# EAGLE design alphanewt_v1.3 (EAGLE 8.2.2)
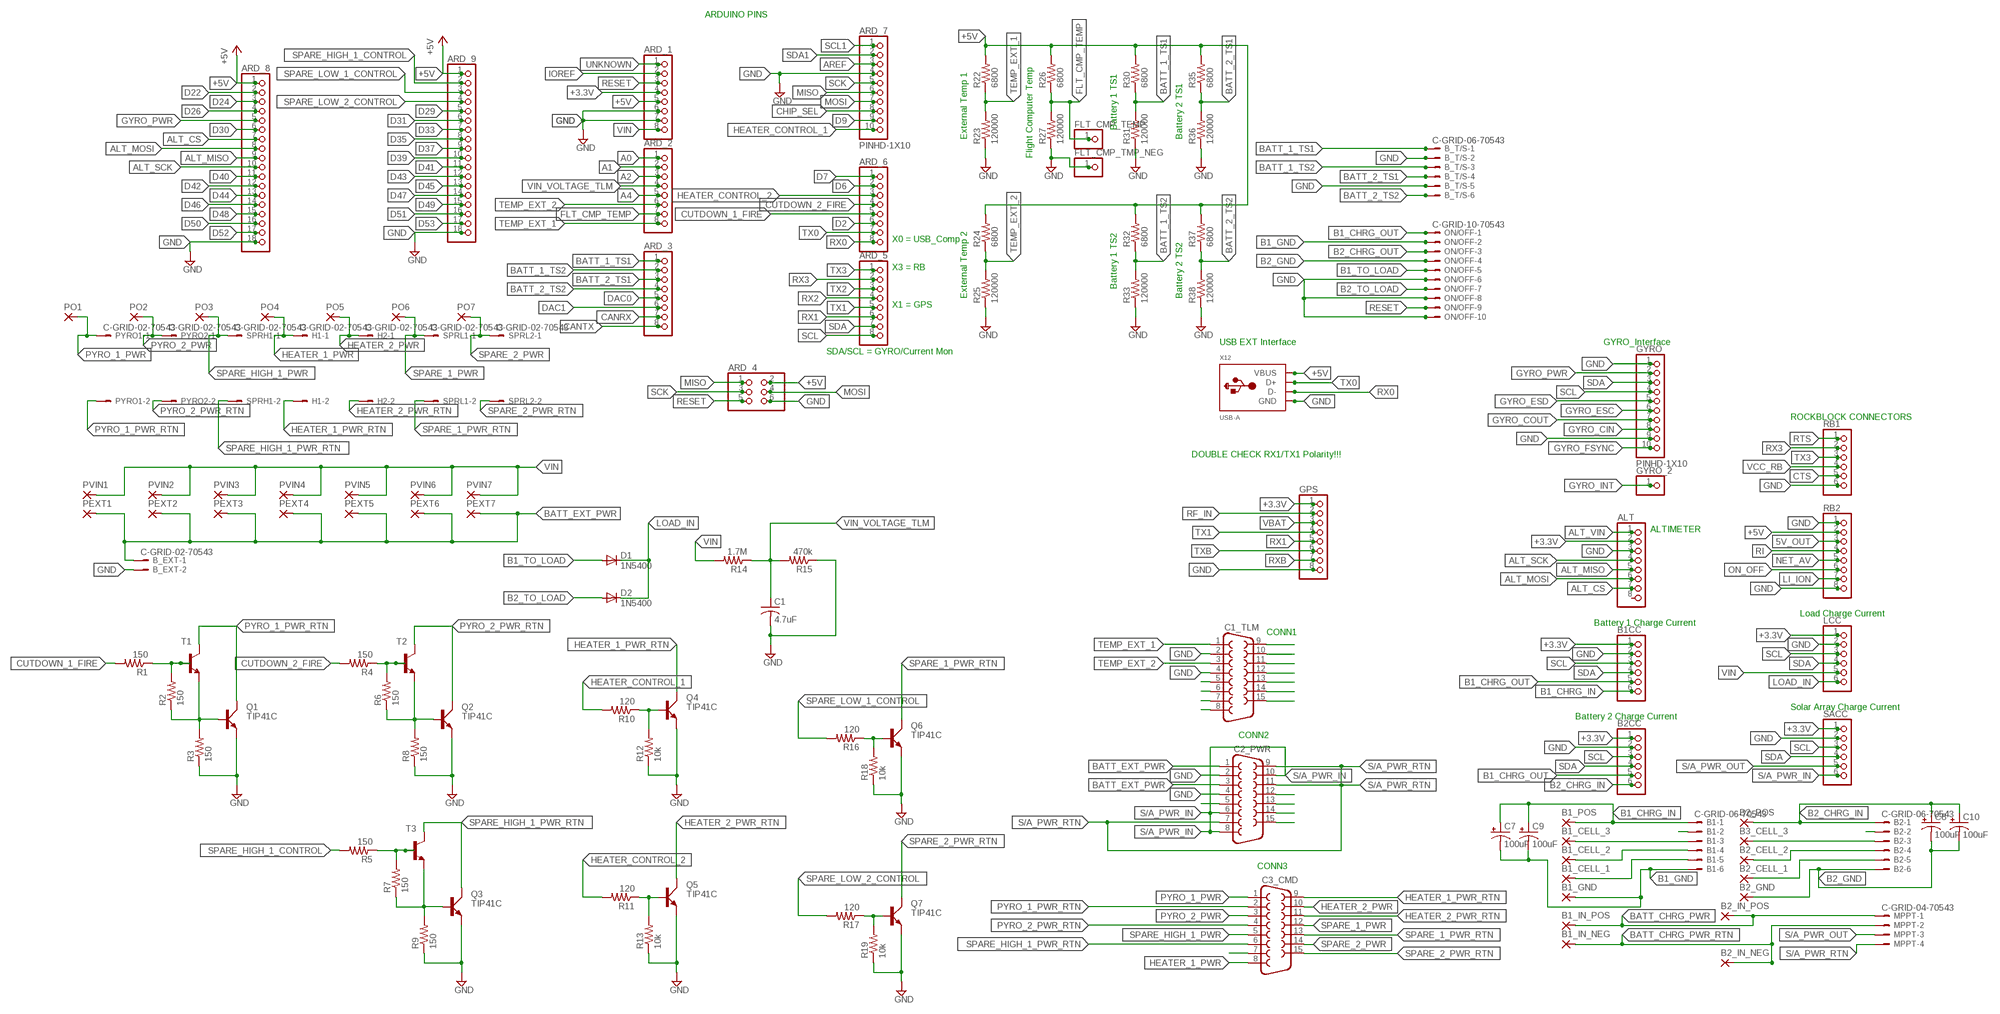
[diagram p0: schematic, sheet 1]

## Parts
ALT  PINHD-1X8BIG  [1X08-BIG]
ARD_1  PINHD-1X8BIG  [1X08-BIG]
ARD_2  PINHD-1X8BIG  [1X08-BIG]
ARD_3  PINHD-1X8BIG  [1X08-BIG]
ARD_4  PINHD-2X3  [2X03]
ARD_5  PINHD-1X8BIG  [1X08-BIG]
ARD_6  PINHD-1X8BIG  [1X08-BIG]
ARD_7  PINHD-1X10  [1X10-BIG]
ARD_8  PINHD-1X18-BIG  [1X18-BIG]
ARD_9  PINHD-1X18-BIG  [1X18-BIG]
B1  C-GRID-06-70543  [70543-06]
B1_CELL_1  SMD5  [SMD2,54-5,08]
B1_CELL_2  SMD5  [SMD2,54-5,08]
B1_CELL_3  SMD5  [SMD2,54-5,08]
B1_GND  SMD5  [SMD2,54-5,08]
B1_IN_NEG  SMD5  [SMD2,54-5,08]
B1_IN_POS  SMD5  [SMD2,54-5,08]
B1_POS  SMD5  [SMD2,54-5,08]
B1CC  PINHD-1X6B  [1X06-BIG]
B2  C-GRID-06-70543  [70543-06]
B2_CELL_1  SMD5  [SMD2,54-5,08]
B2_CELL_2  SMD5  [SMD2,54-5,08]
B2_GND  SMD5  [SMD2,54-5,08]
B2_IN_NEG  SMD5  [SMD2,54-5,08]
B2_IN_POS  SMD5  [SMD2,54-5,08]
B2_POS  SMD5  [SMD2,54-5,08]
B2CC  PINHD-1X6B  [1X06-BIG]
B3_CELL_3  SMD5  [SMD2,54-5,08]
B_EXT  C-GRID-02-70543  [70543-02]
B_T/S  C-GRID-06-70543  [70543-06]
C1  4.7uF  C-USC0805K  [C0805K]
C1_TLM  F15HP  [F15HP]
C2_PWR  F15HP  [F15HP]
C3_CMD  F15HP  [F15HP]
C7  100uF  CPOL-USCT7343  [CT7343]
C8  100uF  CPOL-USCT7343  [CT7343]
C9  100uF  CPOL-USCT7343  [CT7343]
C10  100uF  CPOL-USCT7343  [CT7343]
D1  1N5400  [DO201-15]
D2  1N5400  [DO201-15]
FLT_CMP_TEMP  PINHD-1X1  [1X01]
FLT_CMP_TMP_NEG  PINHD-1X1  [1X01]
GPS  PINHD-1X8BIG  [1X08-BIG]
GYRO  PINHD-1X10  [1X10-BIG]
GYRO_2  PINHD-1X1  [1X01]
H1  C-GRID-02-70543  [70543-02]
H2  C-GRID-02-70543  [70543-02]
LCC  PINHD-1X6B  [1X06-BIG]
MPPT  C-GRID-04-70543  [70543-04]
ON/OFF  C-GRID-10-70543  [70543-10]
PEXT1  SMD2  [SMD1,27-2,54]
PEXT2  SMD2  [SMD1,27-2,54]
PEXT3  SMD2  [SMD1,27-2,54]
PEXT4  SMD2  [SMD1,27-2,54]
PEXT5  SMD2  [SMD1,27-2,54]
PEXT6  SMD2  [SMD1,27-2,54]
PEXT7  SMD2  [SMD1,27-2,54]
PO1  SMD2  [SMD1,27-2,54]
PO2  SMD2  [SMD1,27-2,54]
PO3  SMD2  [SMD1,27-2,54]
PO4  SMD2  [SMD1,27-2,54]
PO5  SMD2  [SMD1,27-2,54]
PO6  SMD2  [SMD1,27-2,54]
PO7  SMD2  [SMD1,27-2,54]
PVIN1  SMD2  [SMD1,27-2,54]
PVIN2  SMD2  [SMD1,27-2,54]
PVIN3  SMD2  [SMD1,27-2,54]
PVIN4  SMD2  [SMD1,27-2,54]
PVIN5  SMD2  [SMD1,27-2,54]
PVIN6  SMD2  [SMD1,27-2,54]
PVIN7  SMD2  [SMD1,27-2,54]
PYRO1  C-GRID-02-70543  [70543-02]
PYRO2  C-GRID-02-70543  [70543-02]
Q1  TIP41C  [TO220AV]
Q2  TIP41C  [TO220AV]
Q3  TIP41C  [TO220AV]
Q4  TIP41C  [TO220AV]
Q5  TIP41C  [TO220AV]
Q6  TIP41C  [TO220AV]
Q7  TIP41C  [TO220AV]
R1  150  R-US_R0805  [R0805]
R2  150  R-US_R0805  [R0805]
R3  150  R-US_R0805  [R0805]
R4  150  R-US_R0805  [R0805]
R5  150  R-US_R0805  [R0805]
R6  150  R-US_R0805  [R0805]
R7  150  R-US_R0805  [R0805]
R8  150  R-US_R0805  [R0805]
R9  150  R-US_R0805  [R0805]
R10  120  R-US_R0805  [R0805]
R11  120  R-US_R0805  [R0805]
R12  10k  R-US_R0805  [R0805]
R13  10k  R-US_R0805  [R0805]
R14  1.7M  R-US_R0805  [R0805]
R15  470k  R-US_R0805  [R0805]
R16  120  R-US_R0805  [R0805]
R17  120  R-US_R0805  [R0805]
R18  10k  R-US_R0805  [R0805]
R19  10k  R-US_R0805  [R0805]
R22  6800  R-US_R0805  [R0805]
R23  120000  R-US_R0805  [R0805]
R24  6800  R-US_R0805  [R0805]
R25  120000  R-US_R0805  [R0805]
R26  6800  R-US_R0805  [R0805]
R27  120000  R-US_R0805  [R0805]
R30  6800  R-US_R0805  [R0805]
R31  120000  R-US_R0805  [R0805]
R32  6800  R-US_R0805  [R0805]
R33  120000  R-US_R0805  [R0805]
R35  6800  R-US_R0805  [R0805]
R36  120000  R-US_R0805  [R0805]
R37  6800  R-US_R0805  [R0805]
R38  120000  R-US_R0805  [R0805]
RB1  PINHD-1X6CB  [1X06-CLEANBIG]
RB2  PINHD-1X8BIG  [1X08-BIG]
SACC  PINHD-1X6B  [1X06-BIG]
SPRH1  C-GRID-02-70543  [70543-02]
SPRL1  C-GRID-02-70543  [70543-02]
SPRL2  C-GRID-02-70543  [70543-02]
T1  2N3904  [TO92]
T2  2N3904  [TO92]
T3  2N3904  [TO92]
X12  USB-A  [MOLEX_480371000]

## Nets
5V_OUT: RB2.3
+3.3V: ALT.2 ARD_1.4 B1CC.1 B2CC.1 GPS.1 LCC.1 SACC.1
+5V: ARD_1.5 ARD_4.2 ARD_8.1 ARD_9.1 R22.2 R24.2 R26.2 R30.2 R32.2 R35.2 R37.2 RB2.2 X12.1(VBUS)
A0: ARD_2.1
A1: ARD_2.2
A2: ARD_2.3
A4: ARD_2.5
ALT_CS: ALT.7 ARD_8.7
ALT_MISO: ALT.5 ARD_8.9
ALT_MOSI: ALT.6 ARD_8.8
ALT_SCK: ALT.4 ARD_8.10
ALT_VIN: ALT.1
AREF: ARD_7.3
B1_CHRG_IN [PWR]: B1.1 B1_POS.1(P) B1CC.6 C7.+ C9.+
B1_CHRG_OUT [PWR]: B1CC.5 B2CC.5 ON/OFF.1
B1_GND [PWR]: B1.6 B1_GND.1(P) C7.- C9.- ON/OFF.2
B1_TO_LOAD [PWR]: D1.A ON/OFF.5
B2_CHRG_IN [PWR]: B2.1 B2_POS.1(P) B2CC.6 C8.+ C10.+
B2_CHRG_OUT [PWR]: ON/OFF.3
B2_GND [PWR]: B2.6 B2_GND.1(P) C8.- C10.- ON/OFF.4
B2_TO_LOAD [PWR]: D2.A ON/OFF.7
BATT_1_TS1: ARD_3.1 B_T/S.1 R30.1 R31.2
BATT_1_TS2: ARD_3.2 B_T/S.3 R32.1 R33.2
BATT_2_TS1: ARD_3.3 B_T/S.4 R35.1 R36.2
BATT_2_TS2: ARD_3.4 B_T/S.6 R37.1 R38.2
BATT_CHRG_PWR [PWR]: B1_IN_POS.1(P) B2_IN_POS.1(P) MPPT.1
BATT_CHRG_PWR_RTN [PWR]: B1_IN_NEG.1(P) B2_IN_NEG.1(P) MPPT.2
BATT_EXT_PWR [PWR]: B_EXT.1 C2_PWR.1 C2_PWR.3 PEXT1.1(P) PEXT2.1(P) PEXT3.1(P) PEXT4.1(P) PEXT5.1(P) PEXT6.1(P) PEXT7.1(P)
CANRX: ARD_3.7
CANTX: ARD_3.8
CHIP_SEL: ARD_7.8
CTS: RB1.5
CUTDOWN_1_FIRE: ARD_6.5 R1.2
CUTDOWN_2_FIRE: ARD_6.4 R4.2
D2: ARD_6.6
D6: ARD_6.2
D7: ARD_6.1
D9: ARD_7.9
D22: ARD_8.2
D24: ARD_8.3
D26: ARD_8.4
D29: ARD_9.5
D30: ARD_8.6
D31: ARD_9.6
D33: ARD_9.7
D35: ARD_9.8
D37: ARD_9.9
D39: ARD_9.10
D40: ARD_8.11
D41: ARD_9.11
D42: ARD_8.12
D43: ARD_9.12
D44: ARD_8.13
D45: ARD_9.13
D46: ARD_8.14
D47: ARD_9.14
D48: ARD_8.15
D49: ARD_9.15
D50: ARD_8.16
D51: ARD_9.16
D52: ARD_8.17
D53: ARD_9.17
DAC0: ARD_3.5
DAC1: ARD_3.6
FLT_CMP_TEMP: ARD_2.7 FLT_CMP_TEMP.1 R26.1 R27.2
GND: ALT.3 ARD_1.6 ARD_1.7 ARD_4.6 ARD_7.4 ARD_8.18 ARD_9.18 B1CC.2 B2CC.2 B_EXT.2 B_T/S.2 B_T/S.5 C1.2 C1_TLM.2 C1_TLM.4 C2_PWR.2 C2_PWR.4 FLT_CMP_TMP_NEG.1 GPS.8 GYRO.1 GYRO.9 LCC.2 ON/OFF.6 ON/OFF.8 ON/OFF.10 Q1.E Q2.E Q3.E Q4.E Q5.E Q6.E Q7.E R3.1 R8.1 R9.1 R12.1 R13.1 R15.1 R18.1 R19.1 R23.1 R25.1 R27.1 R31.1 R33.1 R36.1 R38.1 RB1.6 RB2.1 RB2.8 SACC.2 X12.4(GND)
GYRO_CIN: GYRO.8
GYRO_COUT: GYRO.7
GYRO_ESC: GYRO.6
GYRO_ESD: GYRO.5
GYRO_FSYNC: GYRO.10
GYRO_INT: GYRO_2.1
GYRO_PWR: ARD_8.5 GYRO.2
HEATER_1_PWR [PWR]: C3_CMD.8 H1.1 PO4.1(P)
HEATER_1_PWR_RTN [PWR]: C3_CMD.9 H1.2 Q4.C
HEATER_2_PWR [PWR]: C3_CMD.10 H2.1 PO5.1(P)
HEATER_2_PWR_RTN [PWR]: C3_CMD.11 H2.2 Q5.C
HEATER_CONTROL_1: ARD_7.10 R10.2
HEATER_CONTROL_2: ARD_6.3 R11.2
IOREF: ARD_1.2
LI_ION: RB2.7
LOAD_IN [PWR]: D1.C D2.C LCC.6
MISO: ARD_4.1 ARD_7.6
MOSI: ARD_4.4 ARD_7.7
N$1: B1.2
N$2: B2.2
N$12: C1_TLM.9
N$13: C1_TLM.10
N$15: R4.1 R6.2 T2.2(B)
N$16: R1.1 R2.2 T1.2(B)
N$18: Q4.B R10.1 R12.2
N$19: Q2.B R6.1 R8.2 T2.3(E)
N$20: C1_TLM.11
N$21: C1_TLM.12
N$22: Q5.B R11.1 R13.2
N$23: Q1.B R2.1 R3.2 T1.3(E)
N$24: Q6.B R16.1 R18.2
N$25: C1_TLM.13
N$26: R5.1 R7.2 T3.2(B)
N$27: Q3.B R7.1 R9.2 T3.3(E)
N$28: C1_TLM.14
N$29 [PWR]: B1.5 B1_CELL_1.1(P)
N$30: C1_TLM.15
N$31: Q7.B R17.1 R19.2
N$33 [PWR]: B1.4 B1_CELL_2.1(P)
N$34 [PWR]: B2.3 B3_CELL_3.1(P)
N$35 [PWR]: B2.4 B2_CELL_2.1(P)
N$36 [PWR]: B2.5 B2_CELL_1.1(P)
N$37 [PWR]: B1.3 B1_CELL_3.1(P)
N$40: C1_TLM.5
N$41: C1_TLM.6
N$42: C1_TLM.7
N$43: C1_TLM.8
N$47: C2_PWR.12
N$48: C2_PWR.13
N$49: C2_PWR.14
N$50: C2_PWR.15
N$55: C2_PWR.5
N$72 [PWR]: C3_CMD.7
NET_AV: RB2.5
ON_OFF: RB2.6
PYRO_1_PWR [PWR]: C3_CMD.1 PO1.1(P) PYRO1.1
PYRO_1_PWR_RTN [PWR]: C3_CMD.2 PYRO1.2 Q1.C T1.1(C)
PYRO_2_PWR [PWR]: C3_CMD.3 PO2.1(P) PYRO2.1
PYRO_2_PWR_RTN [PWR]: C3_CMD.4 PYRO2.2 Q2.C T2.1(C)
RESET: ARD_1.3 ARD_4.5 ON/OFF.9
RF_IN: GPS.2
RI: RB2.4
RTS: RB1.1
RX0: ARD_6.8 X12.2(D-)
RX1: ARD_5.6 GPS.5
RX2: ARD_5.4
RX3: ARD_5.2 RB1.2
RXB: GPS.7
S/A_PWR_IN [PWR]: C2_PWR.6 C2_PWR.8 C2_PWR.10 SACC.6
S/A_PWR_OUT [PWR]: MPPT.3 SACC.5
S/A_PWR_RTN [PWR]: C2_PWR.7 C2_PWR.9 C2_PWR.11 MPPT.4
SCK: ARD_4.3 ARD_7.5
SCL: ARD_5.8 B1CC.3 B2CC.3 GYRO.4 LCC.3 SACC.3
SCL1: ARD_7.1
SDA: ARD_5.7 B1CC.4 B2CC.4 GYRO.3 LCC.4 SACC.4
SDA1: ARD_7.2
SPARE_1_PWR [PWR]: C3_CMD.12 PO6.1(P) SPRL1.1
SPARE_1_PWR_RTN [PWR]: C3_CMD.13 Q6.C SPRL1.2
SPARE_2_PWR [PWR]: C3_CMD.14 PO7.1(P) SPRL2.1
SPARE_2_PWR_RTN [PWR]: C3_CMD.15 Q7.C SPRL2.2
SPARE_HIGH_1_CONTROL: ARD_9.2 R5.2
SPARE_HIGH_1_PWR [PWR]: C3_CMD.5 PO3.1(P) SPRH1.1
SPARE_HIGH_1_PWR_RTN [PWR]: C3_CMD.6 Q3.C SPRH1.2 T3.1(C)
SPARE_LOW_1_CONTROL: ARD_9.3 R16.2
SPARE_LOW_2_CONTROL: ARD_9.4 R17.2
TEMP_EXT_1: ARD_2.8 C1_TLM.1 R22.1 R23.2
TEMP_EXT_2: ARD_2.6 C1_TLM.3 R24.1 R25.2
TX0: ARD_6.7 X12.3(D+)
TX1: ARD_5.5 GPS.4
TX2: ARD_5.3
TX3: ARD_5.1 RB1.3
TXB: GPS.6
UNKNOWN: ARD_1.1
VBAT: GPS.3
VCC_RB: RB1.4
VIN [PWR]: ARD_1.8 LCC.5 PVIN1.1(P) PVIN2.1(P) PVIN3.1(P) PVIN4.1(P) PVIN5.1(P) PVIN6.1(P) PVIN7.1(P) R14.2
VIN_VOLTAGE_TLM: ARD_2.4 C1.1 R14.1 R15.2
Unconnected: ALT.8

## Notes on the sheet
- ARDUINO PINS
- Battery 1 TS1
- External Temp 1 | Battery 2 TS1
- Flight Computer Temp
- X0 = USB_Comp
- X3 = RB
- Battery 1 TS2
- External Temp 2 | Battery 2 TS2
- X1 = GPS
- USB EXT Interface | GYRO_Interface
- SDA/SCL = GYRO/Current Mon
- ROCKBLOCK CONNECTORS
- DOUBLE CHECK RX1/TX1 Polarity!!!
- ALTIMETER
- Load Charge Current
- Battery 1 Charge Current
- CONN1
- Solar Array Charge Current
- Battery 2 Charge Current
- CONN2
- CONN3

## Library data of the parts
ALT ARD_1-ARD_3 ARD_5 ARD_6 GPS RB2 = adafruit:PINHD-1X8: PIN HEADER; OC_NEWARK: unknown
ARD_4 = pinhead:PINHD-2X3: PIN HEADER; OC_NEWARK: unknown
ARD_7 GYRO = adafruit:PINHD-1X10: Pin header 1x10 0.1" spacing With round pins; OC_NEWARK: unknown
ARD_8 ARD_9 = adafruit:PINHD-1X18: PIN HEADER; OC_NEWARK: unknown
B1 B2 B_T/S = con-molex:C-GRID-06: CONNECTOR wire to board 2.54 mm (0.100") pitch header; MF: MOLEX; MPN: 70543-0005; OC_FARNELL: unknown; OC_NEWARK: 59H2647
B1_CELL_1-B1_CELL_3 B1_GND B1_IN_NEG B1_IN_POS B1_POS B2_CELL_1 B2_CELL_2 B2_GND B2_IN_NEG B2_IN_POS B2_POS B3_CELL_3 = wirepad:SMD5: SMD PAD; OC_NEWARK: unknown
B1CC B2CC LCC RB1 SACC = adafruit:PINHD-1X6: PIN HEADER; OC_NEWARK: unknown
B_EXT H1 H2 PYRO1 PYRO2 SPRH1 SPRL1 SPRL2 = con-molex:C-GRID-02: CONNECTOR wire to board 2.54 mm (0.100") pitch header; MF: MOLEX; MPN: 70543-0001; OC_FARNELL: unknown; OC_NEWARK: 59H2645
C1 = adafruit:C-US: CAPACITOR, American symbol; MPN: C2012X6S1H475K125AC; OC_NEWARK: 95Y0059
C1_TLM C2_PWR C3_CMD = adafruit:F15: SUB-D HDH is also known as a 'right angle VGA' connector; MPN: 5504F1-15S-02A-03; OC_NEWARK: 18T0705
C7-C10 = adafruit:CPOL-US: POLARIZED CAPACITOR, American symbol; MPN: TCN4337M020R0100; OC_NEWARK: 13AC9461
D1 D2 = diode:1N5400: DIODE standard rectifier, 3 A, 50 V (Motorola); MPN: 1N5400-E3/54; OC_NEWARK: 05R5997
FLT_CMP_TEMP FLT_CMP_TMP_NEG GYRO_2 = adafruit:PINHD-1X1: Pin header 1x1 for 0.1" spacing With round pins; OC_NEWARK: unknown
MPPT = con-molex:C-GRID-04: CONNECTOR wire to board 2.54 mm (0.100") pitch header; MF: MOLEX; MPN: 70543-0038; OC_FARNELL: unknown; OC_NEWARK: 59H2665
ON/OFF = con-molex:C-GRID-10: CONNECTOR wire to board 2.54 mm (0.100") pitch header; MF: MOLEX; MPN: 70543-0009; OC_FARNELL: unknown; OC_NEWARK: 59H2651
PEXT1-PEXT7 PO1-PO7 PVIN1-PVIN7 = wirepad:SMD2: SMD PAD; OC_NEWARK: unknown
Q1-Q7 = transistor-power:TIP41C: NPN TRANSISTOR; MF: FAIRCHILD SEMICONDUCTOR; MPN: TIP41C; OC_NEWARK: 58K2429
R1-R19 R22-R27 R30-R33 R35-R38 = adafruit:R-US_: RESISTOR, American symbol; MF: VISHAY/DALE; MPN: CRCW120633R2FKEA; OC_NEWARK: 42K4999
T1-T3 = transistor:2N3904: NPN TRANSISTOR; MF: NTE ELECTRONICS; MPN: 2N3904; OC_NEWARK: 33C8259
X12 = adafruit:USB-A: USB type A 'plug' Used for things that can directly connect to a USB port, say USB key; MPN: UE27-AC54-10H; OC_NEWARK: 01M3183

## Net classes
0 default: width 0.305 mm, drill 0.508 mm, clearance 0.254 mm
1 PWR: width 0.406 mm, drill 0.508 mm, clearance 0.305 mm

## Board
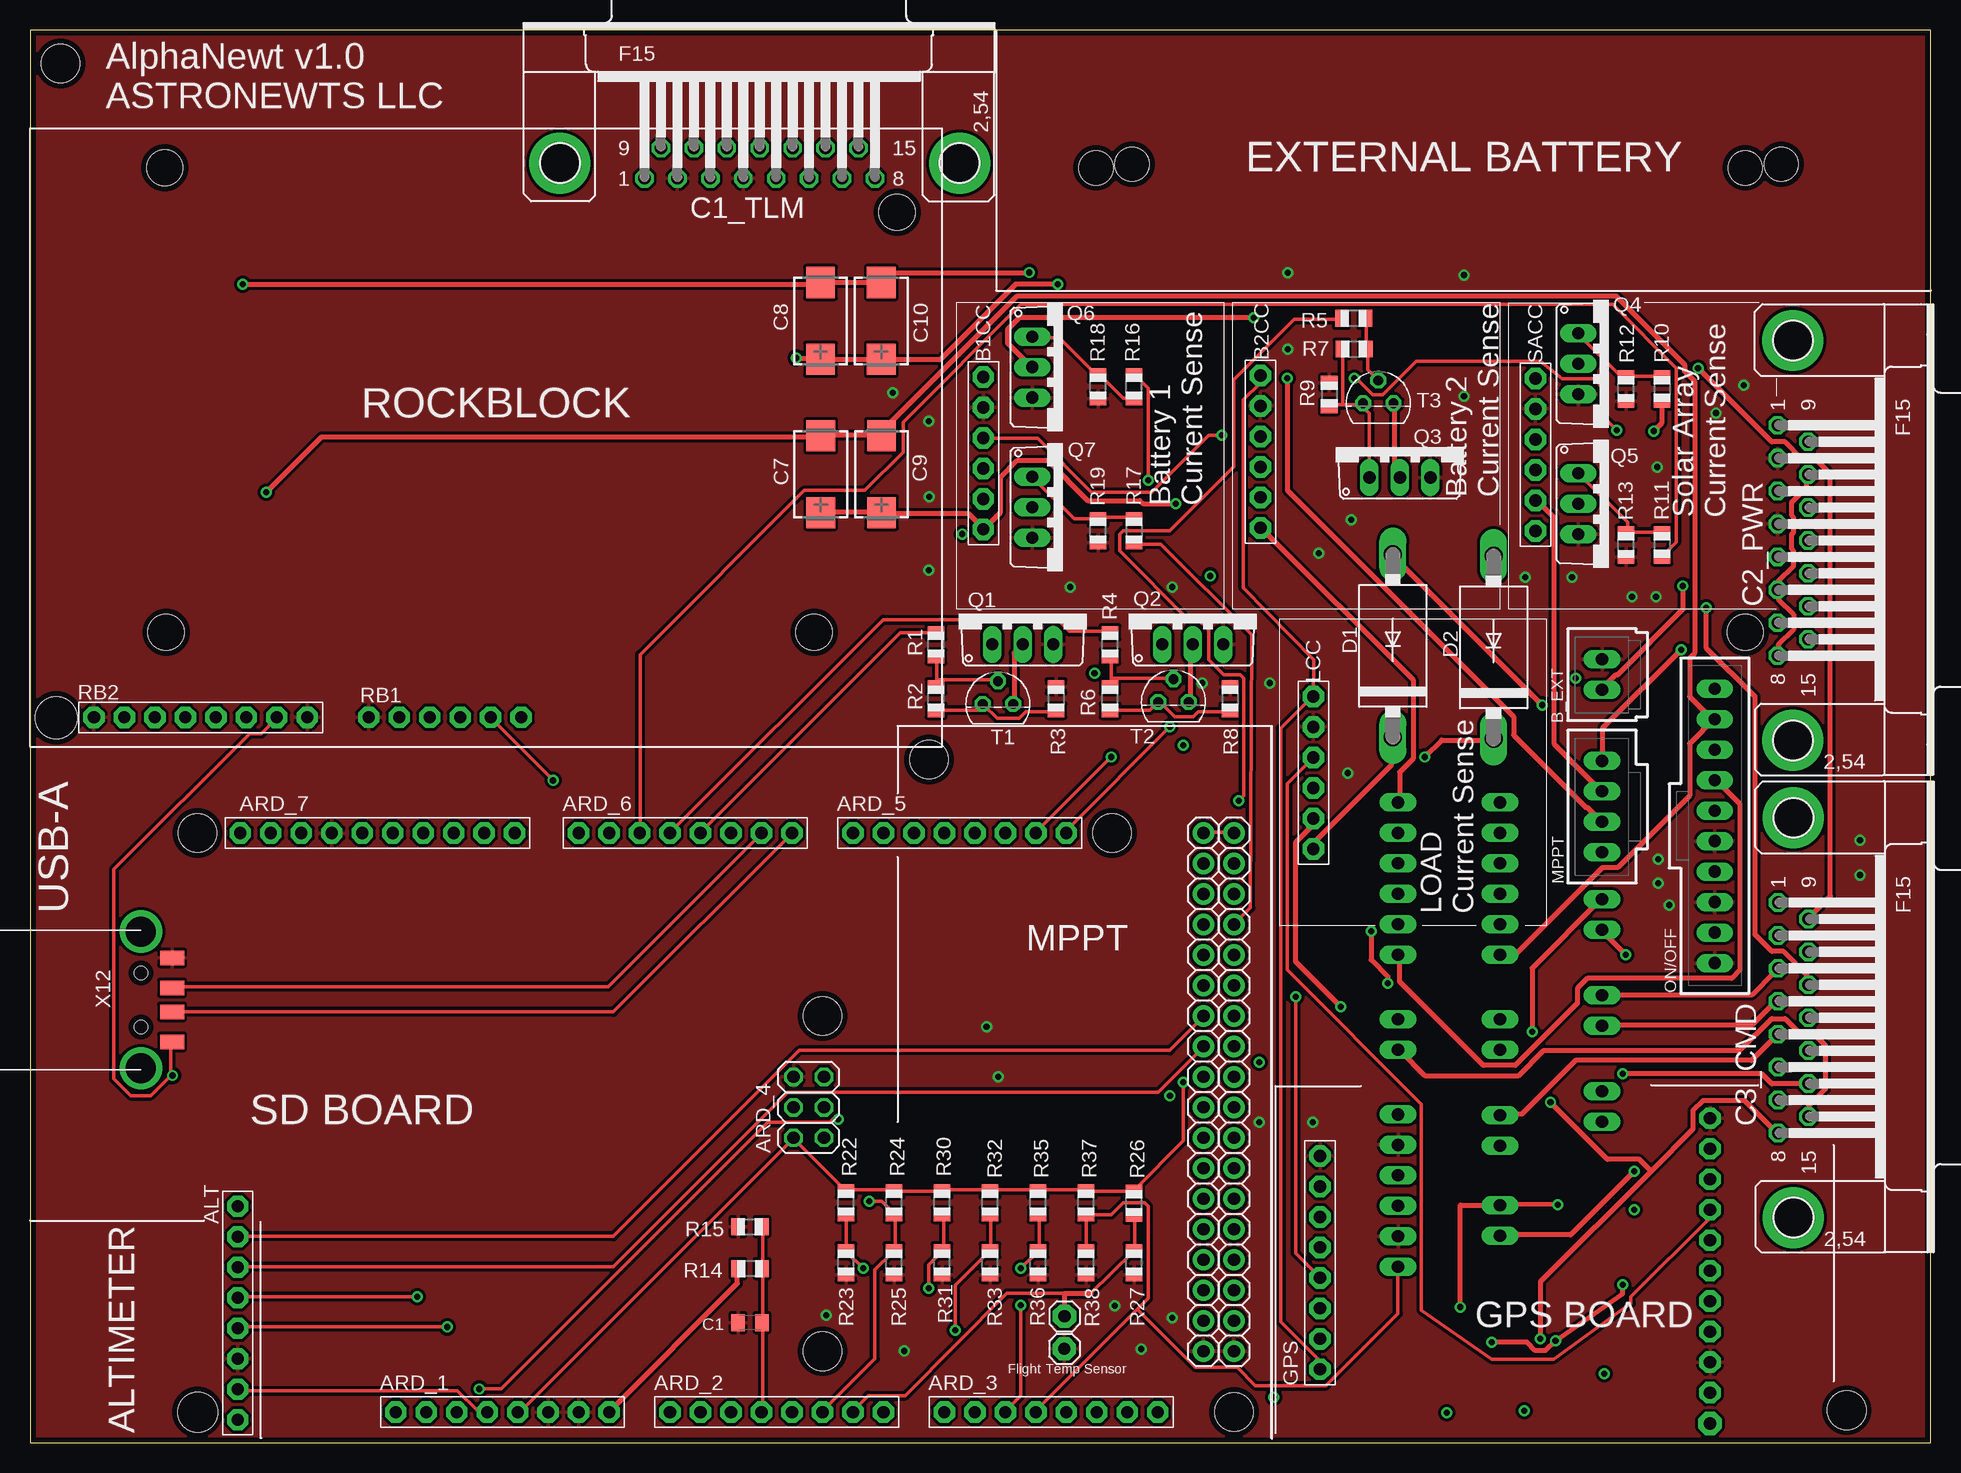
[diagram p1: board, top side]
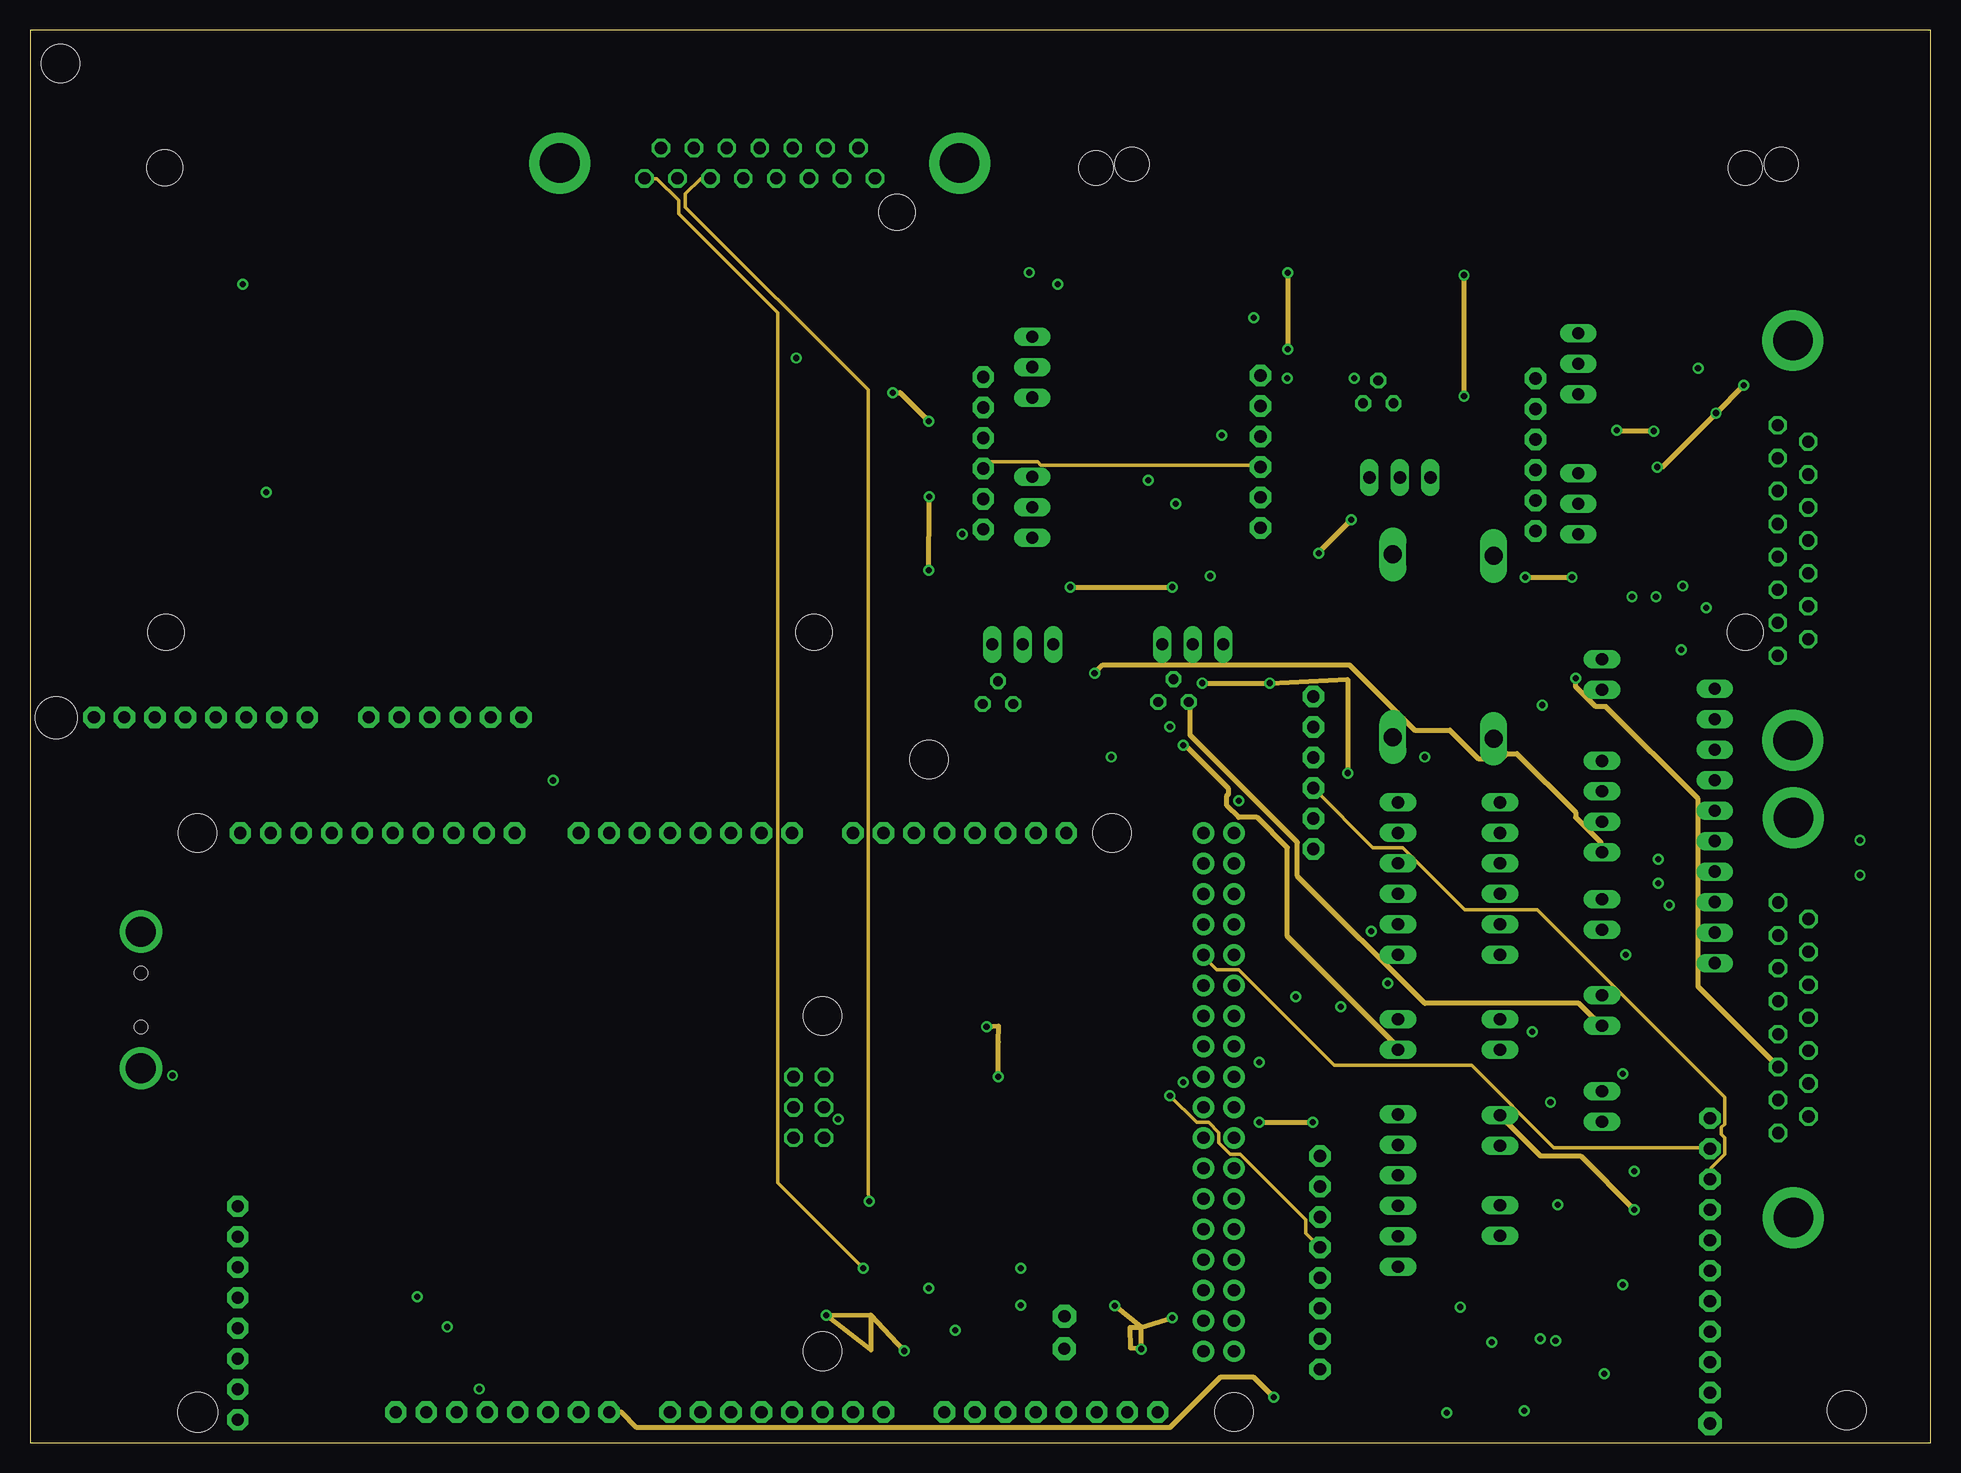
[diagram p2: board, inner layer Route2]
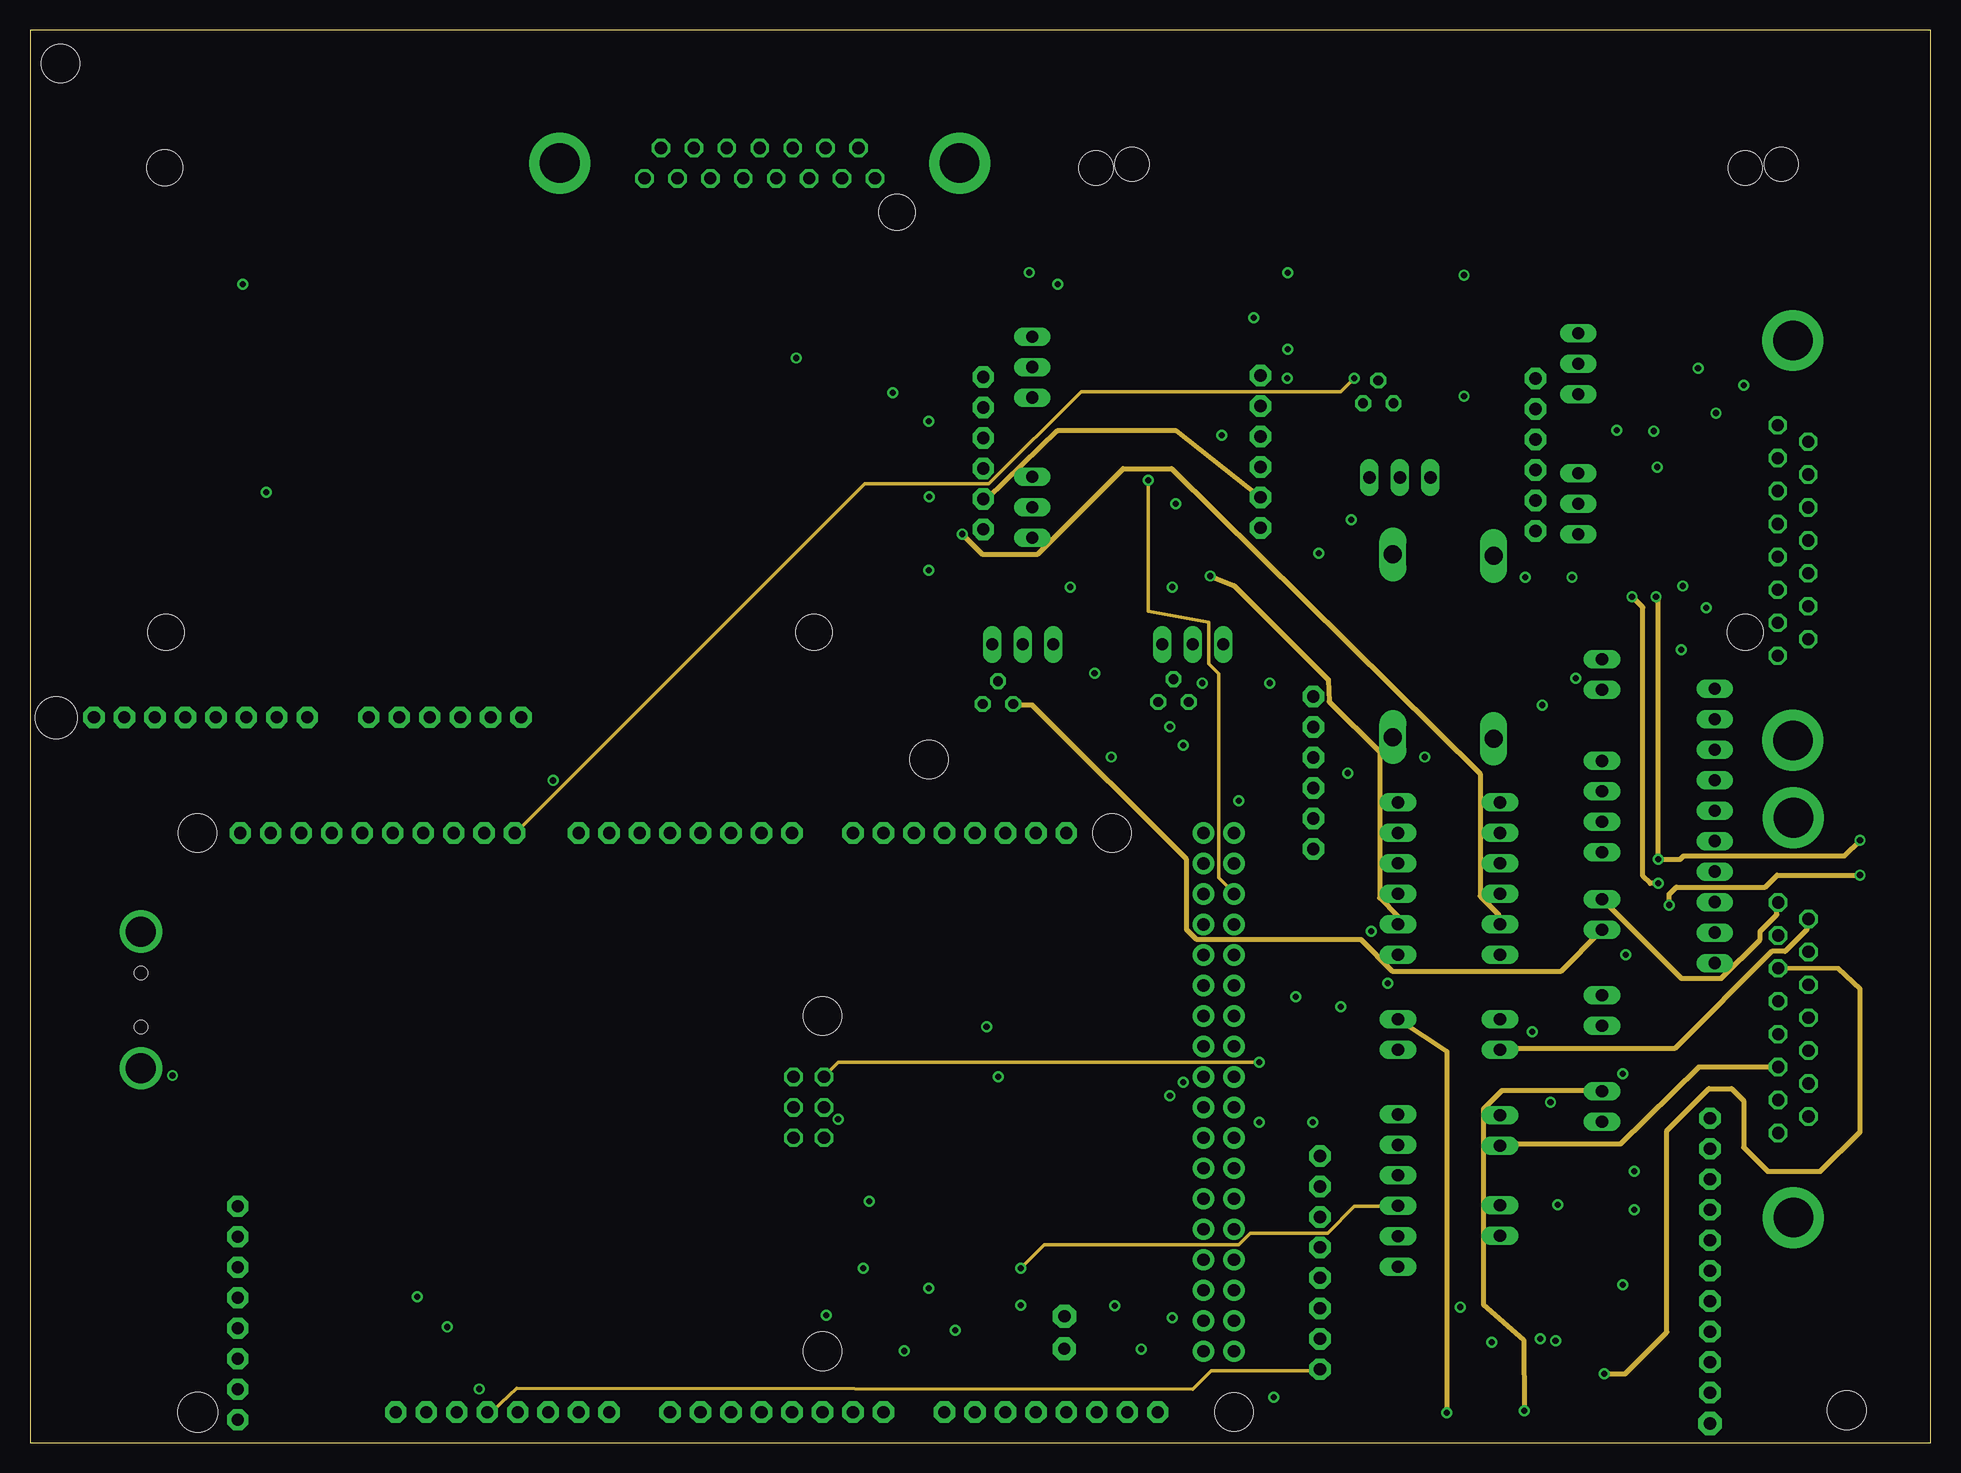
[diagram p3: board, inner layer Route15]
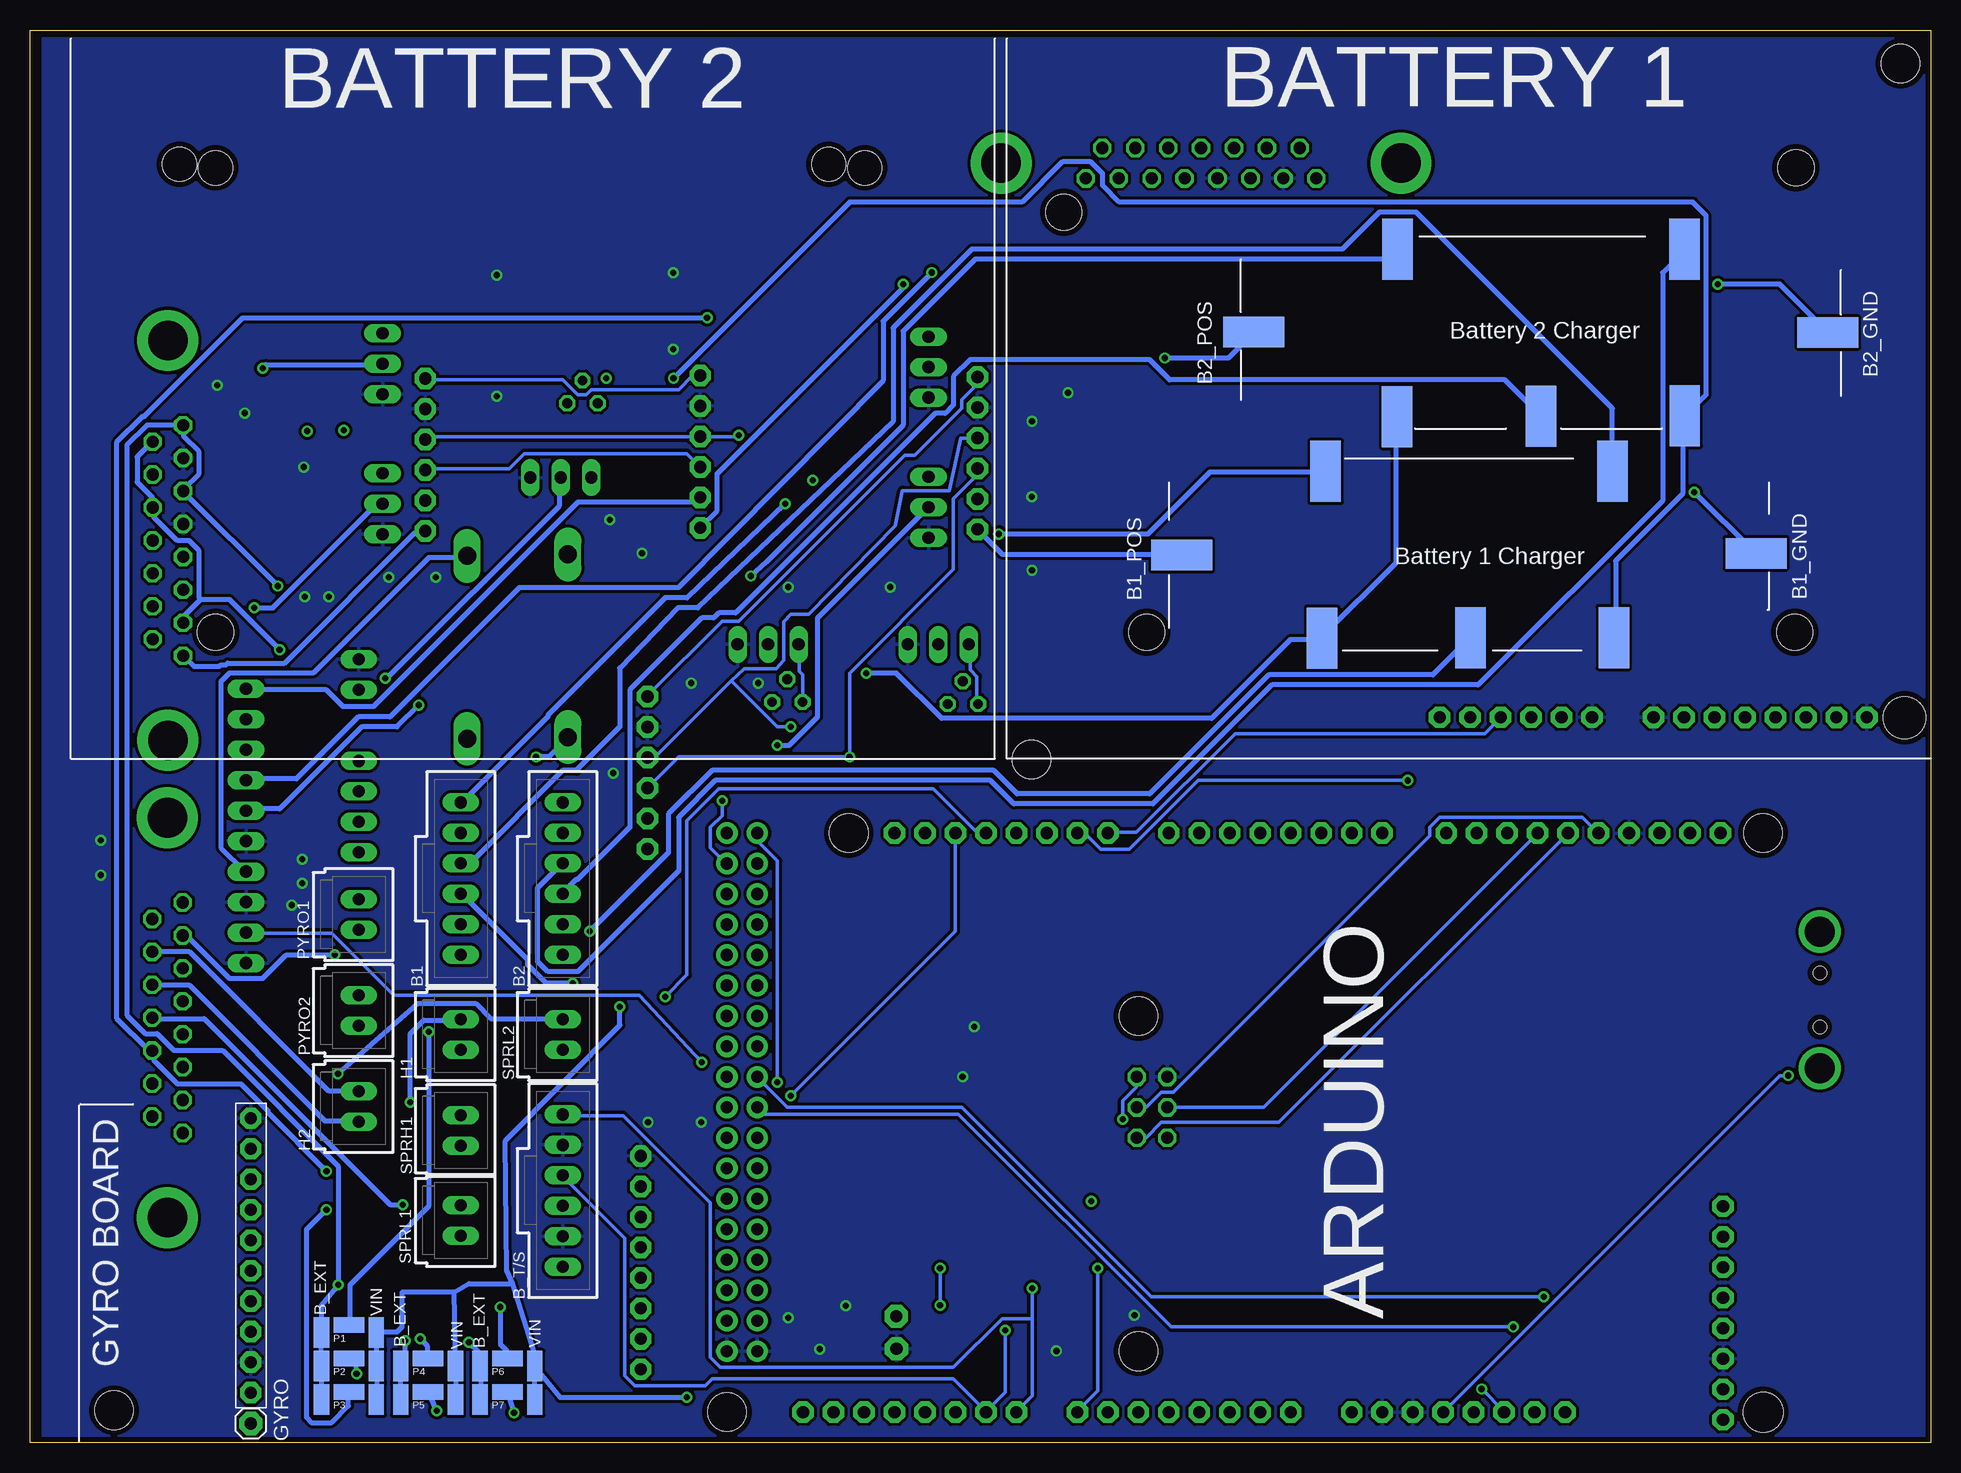
[diagram p4: board, bottom side, seen from below]

Size 158.4 x 117.72 mm. Coordinates in mm from the lower left corner, seen from the top.
Outline: 0,0 158.4,0 158.4,117.72 0,117.72 0,0
Copper layers ((1*2)+(15*16)): Top 0.035mm / dielectric 0.2mm / Route2 0.035mm / dielectric 0.2mm / Route15 0.035mm / dielectric 0.2mm / Bottom 0.035mm
Design rules "default *": minimum track width 6mil, minimum drill 0.35mm, track to track 6mil, track to pad 6mil, pad to pad 6mil, via to via 6mil, smd to smd 6mil, copper to edge 18mil, drill to drill 6mil, minimum pad ring 10mil, minimum via ring 8mil, stop-mask expansion 4mil, vias tented up to drill 0mil, thermal gap 10mil
Holes 3.2 mm at 151.4,2.7 100.33,2.54 66.04,7.62 66.04,35.56 90.17,50.8 13.97,50.8 2.54,114.94 74.93,56.94
Holes 3.3 mm at 13.97,2.54
Holes 3.5 mm at 2.18,60.4
Holes 3 mm at 72.25,102.54 11.34,67.53 65.34,67.53 11.24,106.23 142.94,67.53
Holes 2.85 mm at 88.84,106.23 142.94,106.23 91.84,106.53 145.94,106.53

### Footprints (pad centres in the part's own frame; a part is rotated, then mirrored left to right if it is on the bottom)
1X08-BIG = drill 1.016 pad 1.778 octagon: 1 -8.89,0; 2 -6.35,0; 3 -3.81,0; 4 -1.27,0; 5 1.27,0; 6 3.81,0; 7 6.35,0; 8 8.89,0
2X03 = drill 1.016 octagon: 1 -2.54,-1.27; 2 -2.54,1.27; 3 0,-1.27; 4 0,1.27; 5 2.54,-1.27; 6 2.54,1.27
1X10-BIG = drill 1.016 pad 1.778 octagon: 1 -11.43,0; 2 -8.89,0; 3 -6.35,0; 4 -3.81,0; 5 -1.27,0; 6 1.27,0; 7 3.81,0; 8 6.35,0; 9 8.89,0; 10 11.43,0
1X18-BIG = drill 1.016 pad 1.778: 1 -21.59,0; 2 -19.05,0; 3 -16.51,0; 4 -13.97,0; 5 -11.43,0; 6 -8.89,0; 7 -6.35,0; 8 -3.81,0; 9 -1.27,0; 10 1.27,0; 11 3.81,0; 12 6.35,0; 13 8.89,0; 14 11.43,0; 15 13.97,0; 16 16.51,0; 17 19.05,0; 18 21.59,0
70543-06 = drill 1.016 long: 1 -6.35,0; 2 -3.81,0; 3 -1.27,0; 4 1.27,0; 5 3.81,0; 6 6.35,0
SMD2,54-5,08 = smd 2.54 x 5.08: 1 0,0
1X06-BIG = drill 1.016 pad 1.778 octagon: 1 -6.35,0; 2 -3.81,0; 3 -1.27,0; 4 1.27,0; 5 3.81,0; 6 6.35,0
70543-02 = drill 1.016 long: 1 -1.27,0; 2 1.27,0
C0805K = smd 1.1 x 1.4: 1 -1,0; 2 1,0
F15HP = drill 1.016 octagon: 1 -9.601,-1.27; 2 -6.858,-1.27; 3 -4.115,-1.27; 4 -1.372,-1.27; 5 1.372,-1.27; 6 4.115,-1.27; 7 6.858,-1.27; 8 9.601,-1.27; 9 -8.23,1.27; 10 -5.486,1.27; 11 -2.743,1.27; 12 0,1.27; 13 2.743,1.27; 14 5.486,1.27; 15 8.23,1.27 | drill 3.302 pad 5.08: G1 -16.662,0; G2 16.662,0
CT7343 = smd 2.6 x 2.4: + 3.2,0; - -3.2,0
DO201-15 = drill 1.499 long: A 7.62,0; C -7.62,0
1X01 = drill 1.016 pad 1.93 octagon: 1 0,0
70543-04 = drill 1.016 long: 1 -3.81,0; 2 -1.27,0; 3 1.27,0; 4 3.81,0
70543-10 = drill 1.016 long: 1 -11.43,0; 2 -8.89,0; 3 -6.35,0; 4 -3.81,0; 5 -1.27,0; 6 1.27,0; 7 3.81,0; 8 6.35,0; 9 8.89,0; 10 11.43,0
SMD1,27-2,54 = smd 1.27 x 2.54: 1 0,0
TO220AV = drill 1.016 long: B -2.54,-2.54; C 0,-2.54; E 2.54,-2.54
R0805 = smd 1.1 x 1.4: 1 -1,0; 2 1,0
1X06-CLEANBIG = drill 1.016 pad 1.778 octagon: 1 -6.35,0; 2 -3.81,0; 3 -1.27,0; 4 1.27,0; 5 3.81,0; 6 6.35,0
TO92 = drill 0.813 octagon: 1 1.27,0; 2 0,1.905; 3 -1.27,0
MOLEX_480371000 = smd 1.2 x 2: 1 3.5,2.6; 2 1,2.6; 3 -1,2.6; 4 -3.5,2.6 | drill 2.5: M1 -5.7,0; M2 5.7,0 | hole 1.1: -2.25,0; 2.25,0

### Placement (x,y rotation side)
ALT  17.31,10.8 90 top
ARD_1  39.37,2.54 0 top
ARD_2  62.23,2.54 0 top
ARD_3  85.09,2.54 0 top
ARD_4  64.9,27.94 90 top
ARD_5  77.47,50.8 0 top
ARD_6  54.61,50.8 0 top
ARD_7  28.96,50.8 0 top
ARD_8  97.79,29.21 270 top
ARD_9  100.33,29.21 270 top
B1  122.5,47 270 bottom
B1_CELL_1  50.44,80.94 0 bottom
B1_CELL_2  38.37,67.06 0 bottom
B1_CELL_3  26.53,80.96 0 bottom
B1_GND  14.55,74.1 270 bottom
B1_IN_NEG  26.4,67.09 0 bottom
B1_IN_POS  50.72,67.04 0 bottom
B1_POS  62.42,73.97 270 bottom
B1CC  79.44,82.45 270 top
B2  114,47 270 bottom
B2_CELL_1  44.44,99.44 0 bottom
B2_CELL_2  32.48,85.54 0 bottom
B2_GND  8.58,92.51 270 bottom
B2_IN_NEG  20.5,85.58 0 bottom
B2_IN_POS  44.48,85.5 0 bottom
B2_POS  56.42,92.54 270 bottom
B2CC  102.54,82.58 270 top
B3_CELL_3  20.51,99.44 0 bottom
B_EXT  131,64 90 top
B_T/S  114,21 270 bottom
C1  60,10 180 top
C1_TLM  60.81,106.62 0 top
C2_PWR  146.91,75.18 270 top
C3_CMD  146.95,35.41 270 top
C7  65.9,80.7 270 top
C8  65.87,93.48 270 top
C9  70.95,80.7 270 top
C10  70.93,93.48 270 top
D1  113.57,66.4 90 top
D2  121.97,66.28 90 top
FLT_CMP_TEMP  86.21,10.53 0 top
FLT_CMP_TMP_NEG  86.19,7.82 0 top
GPS  107.5,15 90 top
GYRO  140,15.6 270 bottom
GYRO_2  140,1.6 180 bottom
H1  122.5,34 270 bottom
H2  131,28 270 bottom
LCC  106.95,55.83 270 top
MPPT  131,53 90 top
ON/OFF  140.4,51.4 270 top
PEXT1  134.11,9.17 0 bottom
PEXT2  134.11,6.37 0 bottom
PEXT3  134.11,3.58 0 bottom
PEXT4  127.51,6.37 0 bottom
PEXT5  127.51,3.58 180 bottom
PEXT6  120.9,6.37 0 bottom
PEXT7  120.9,3.58 0 bottom
PO1  131.83,9.8 90 bottom
PO2  131.83,7.01 270 bottom
PO3  131.83,4.21 270 bottom
PO4  125.22,7.01 270 bottom
PO5  125.22,4.21 270 bottom
PO6  118.62,7.01 270 bottom
PO7  118.62,4.21 270 bottom
PVIN1  129.54,9.17 180 bottom
PVIN2  129.54,6.37 0 bottom
PVIN3  129.54,3.58 0 bottom
PVIN4  122.94,6.37 0 bottom
PVIN5  122.94,3.58 180 bottom
PVIN6  116.33,6.37 0 bottom
PVIN7  116.33,3.58 0 bottom
PYRO1  131,44 270 bottom
PYRO2  131,36 270 bottom
Q1  82.72,69.06 0 top
Q2  96.9,69.06 0 top
Q3  114.16,82.96 0 top
Q4  131.56,89.91 270 top
Q5  131.56,78.23 270 top
Q6  86.06,89.63 270 top
Q7  86.06,77.95 270 top
R1  75.5,66.5 90 top
R2  75.5,62 90 top
R3  85.5,62 270 top
R4  90,66.5 90 top
R5  110.3,93.69 180 top
R6  90,62 90 top
R7  110.34,91.14 0 top
R8  100,62 270 top
R9  108.28,87.34 270 top
R10  136,87.8 270 top
R11  136,74.8 270 top
R12  133,87.8 90 top
R13  133,74.8 90 top
R14  60,14.5 180 top
R15  60,18 0 top
R16  92,88 90 top
R17  92,76 270 top
R18  89,88 90 top
R19  89,76 90 top
R22  68,20 90 top
R23  68,15 90 top
R24  72,20 90 top
R25  72,15 90 top
R26  92,19.96 90 top
R27  92,15 90 top
R30  76,20 90 top
R31  76,15 90 top
R32  80,20 90 top
R33  80,15 90 top
R35  84,20 90 top
R36  84,15 90 top
R37  88,20 90 top
R38  88,15 90 top
RB1  34.58,60.45 180 top
RB2  14.22,60.44 180 top
SACC  125.46,82.33 270 top
SPRH1  122.5,26 270 bottom
SPRL1  122.5,18.5 270 bottom
SPRL2  114,34 270 bottom
T1  80.66,61.55 0 top
T2  95.29,61.71 0 top
T3  112.36,86.61 0 top
X12  9.24,36.89 270 top

### Tracks (layer width: path | path; a pad name or v marks a point on that pad's centre or on a via)
+3.3V
  Top 0.305: ARD_1.4 38,2.65 37.3,2.65 35.62,4.33 17.32,4.33 ALT.2 | GPS.1 107.43,6.15 107.43,6.84 104.22,10.06 104.22,59.51 106.87,62.17 LCC.1 106.97,65.25 101.12,71.23 101.12,86.89 102.54,88.29 102.54,88.85 B2CC.1
  Route15 0.305: ARD_1.4 38.14,2.65 38.58,2.65 40.57,4.55 96.89,4.45 98.45,6.01 107.43,6.01 GPS.1
  Bottom 0.305: B2CC.1 102.68,88.85 103.24,88.85 104.36,87.73 111.62,87.73 112.04,87.31 112.74,87.31 114,88.57 125.45,88.57 SACC.1 | B1CC.1 79.49,88.71 79.49,88.15 80.75,86.89 80.75,86.19 84.66,82.28 85.5,82.28 99.33,68.45 100.72,68.45 106.87,62.31 LCC.1
+5V  (via drill 0.51)
  Top 0.305: 11.73,30.59 11.73,33.39 X12.1 | 11.73,30.59 10.06,28.92 8.38,28.92 6.99,30.32 6.99,47.78 18.3,59.09 19.28,59.09 20.54,60.35 RB2.2 | ARD_8.1 97.79,50.85 100.31,50.85 ARD_9.1 | ARD_1.5 40.65,2.65 40.93,2.65 63.56,25.29 ARD_4.2 63.7,25.29 67.89,21.09 R22.2 68.03,21.09 71.94,21.09 R24.2 72.08,20.95 75.86,20.95 R30.2 76.14,21.09 79.91,21.09 R32.2 80.05,21.09 83.96,21.09 R35.2 84.1,21.09 87.87,21.09 R37.2 88.15,20.95 91.92,20.95 R26.2 92.06,21.09 96.11,25.15 v96.11,30.04 | v11.87,30.59 11.73,30.59
  Bottom 0.305: ARD_8.1 97.79,50.15 96.11,48.48 v96.11,30.04 | v11.87,30.59 12.57,30.59 40.51,2.65 ARD_1.5
ALT_CS
  Top 0.305: ALT.7 17.32,17.18 48.62,17.18 64.12,32.69 95,32.69 97.79,35.48 ARD_8.7
ALT_MISO  (via drill 0.51)
  Top 0.305: v32.27,12.15 17.32,12.15 ALT.5
  Bottom 0.305: v32.27,12.15 64.96,12.15 80.75,27.94 95.28,27.94 97.79,30.45 ARD_8.9
ALT_MOSI
  Top 0.305: ALT.6 17.32,14.67 48.62,14.67 63.14,29.2 94.02,29.2 97.79,32.97 ARD_8.8
ALT_SCK  (via drill 0.51)
  Top 0.305: v34.78,9.64 17.32,9.64 ALT.4
  Bottom 0.305: v34.78,9.64 63.28,9.64 81.03,27.38 97.23,27.38 ARD_8.10
B1_CHRG_IN  (via drill 0.51)
  Top 0.406: C7.+ 65.94,77.53 70.83,77.53 C9.+ 70.97,77.39 78.23,77.39 79.35,76.28 B1CC.6 79.49,76.14 80.89,77.53 80.89,80.47 82.28,81.86 84.8,81.86 88.15,78.51 92.48,78.51 92.76,78.25 v95.47,78.25
  Bottom 0.406: v95.47,78.25 103.63,70.39 105.47,70.41 115.25,60.63 115.25,60.49 122.38,53.37 B1.1 | B1_POS.1 62.45,74.04 77.39,74.04 79.35,76 B1CC.6
B1_CHRG_OUT
  Route15 0.406: B1CC.5 79.49,78.65 79.77,78.65 85.62,84.3 95.53,84.3 102.54,78.79 B2CC.5
  Bottom 0.406: ON/OFF.1 140.4,62.73 133.69,62.73 132.3,61.33 129.78,61.33 112.74,78.37 102.96,78.37 102.68,78.65 B2CC.5
B1_GND  (via drill 0.51)
  Top 0.406: B1.6 122.52,40.65 123.77,40.65 131.04,47.92 132.3,47.92 138.3,53.92 138.3,58.26 140.4,60.35 ON/OFF.2 140.12,60.35 138.3,62.17 138.3,65.38 138.72,65.8 138.72,88.43 137.88,89.27 137.88,89.83 132.16,95.56 82.28,95.56 70.83,84.1 C9.- 70.83,83.96 65.94,83.96 C7.- 65.8,83.82 24.31,83.82 v19.7,79.21
  Bottom 0.406: v19.7,79.21 14.67,74.18 B1_GND.1
B1_TO_LOAD  (via drill 0.51)
  Top 0.406: v126.01,61.47 113.58,73.9 D1.A
  Bottom 0.406: v126.01,61.47 127.83,59.65 130.76,59.65 137.6,52.81 140.4,52.81 ON/OFF.5
B2_CHRG_IN  (via drill 0.51)
  Top 0.406: v63.84,90.39 65.8,90.39 C8.+ 65.94,90.25 70.83,90.25 C10.+ 71.11,90.25 75.86,90.25 82.14,96.53 v85.64,96.53 | B2.1 114.14,53.37 114.14,55.88 115.25,57 115.25,63.56 102.68,76.14 B2CC.6
  Bottom 0.406: v63.84,90.39 58.53,90.39 56.44,92.48 B2_POS.1 | v85.64,96.53 85.64,96.25 101.14,80.75 101.14,77.67 102.54,76.28 B2CC.6
B2_GND  (via drill 0.51)
  Top 0.406: B2.6 114.14,40.51 114.14,38.42 121.12,31.43 123.77,31.43 128.94,36.6 128.94,37.86 129.78,38.7 141.8,38.7 142.49,39.4 142.49,53.23 140.54,55.18 ON/OFF.4 | v17.74,96.53 65.8,96.53 C8.- 65.94,96.67 70.83,96.67 C10.- 70.97,96.81 71.67,97.51 v83.26,97.51
  Bottom 0.406: v17.74,96.53 12.57,96.53 8.66,92.62 B2_GND.1 | v83.26,97.51 87.31,93.46 87.31,88.51 104.37,71.25 117.63,71.25 128.38,60.49 131.04,60.49 136.21,55.32 140.4,55.32 ON/OFF.4
B2_TO_LOAD
  Bottom 0.406: ON/OFF.7 140.54,47.64 142.49,49.59 142.49,63.42 141.8,64.12 134.81,64.12 125.17,73.76 122.1,73.76 D2.A
BATT_1_TS1  (via drill 0.51)
  Top 0.305: R30.1 76.14,19 76.14,16.07 R31.2 76,15.93 74.88,14.81 v74.88,12.85
  Bottom 0.305: 74.88,10.34 74.88,3.91 76.14,2.65 ARD_3.1 | 74.88,10.34 v74.88,12.85 | 74.88,10.34 77.39,10.34 81.44,6.29 100.86,6.29 101.7,7.12 101.7,19.98 108.97,27.24 114,27.24 B_T/S.1
BATT_1_TS2  (via drill 0.51)
  Top 0.305: R32.1 80.05,19 80.05,16.07 R33.2 79.91,15.93 77.11,13.13 v77.11,9.36
  Bottom 0.305: v77.11,9.36 77.11,4.19 78.65,2.65 ARD_3.2 78.79,2.65 81.44,5.31 101.56,5.31 102.12,4.75 107.99,4.75 108.83,5.59 108.83,17.04 114,22.21 B_T/S.3
BATT_2_TS1  (via drill 0.51)
  Top 0.305: R35.1 84.1,19 84.1,16.07 R36.2 83.96,15.93 v82.56,14.53 | v82.56,11.46 82.56,3.91 81.31,2.65 ARD_3.3
  Route15 0.305: v82.56,14.53 84.52,16.48 100.72,16.48 101.7,17.46 108.13,17.46 110.36,19.7 114,19.7 B_T/S.4
  Bottom 0.305: v82.56,11.46 v82.56,14.53
BATT_2_TS2
  Top 0.305: R38.2 88.01,16.07 R37.1 88.15,19 90.11,19 91.08,19.98 92.9,19.98 93.18,19.7 93.18,12.01 92.27,11.11 | 92.27,11.11 83.82,2.65 ARD_3.4 | 92.27,11.11 97.09,6.29 100.58,6.29 102.12,4.75 107.99,4.75 114,10.76 114,14.53 B_T/S.6
BATT_CHRG_PWR  (via drill 0.51)
  Route2 0.406: v88.71,64.12 89.41,64.82 109.94,64.82 115.39,59.37 118.33,59.37 120.7,57 122.66,57 123.08,57.42 123.91,57.42 128.8,52.53 128.8,52.11 130.9,50.01 130.9,49.31 MPPT.1
  Bottom 0.406: v88.71,64.12 86.19,64.12 82.42,60.35 59.93,60.35 53.37,66.92 50.85,66.92 B1_IN_POS.1 50.71,67.2 44.56,73.34 44.56,85.5 B2_IN_POS.1
BATT_CHRG_PWR_RTN  (via drill 0.51)
  Top 0.406: v104.78,88.71 104.78,79.35 123.64,60.49 123.64,58.95 129.64,52.95 129.78,52.95 130.9,51.83 MPPT.2
  Bottom 0.406: v104.78,88.71 90.11,103.38 75.72,103.38 72.36,106.73 69.99,106.73 69.01,105.75 69.01,104.78 67.61,103.38 19.84,103.38 18.72,102.26 18.72,87.31 20.4,85.64 B2_IN_NEG.1 20.68,85.5 20.68,79.07 26.26,73.48 26.26,67.2 B1_IN_NEG.1
BATT_EXT_PWR  (via drill 0.51)
  Top 0.406: v121.82,8.37 124.75,8.37 125.45,7.67 126.29,7.67 v127.13,8.51 132.72,12.39 v132.72,13.15 | v137.74,71.39 137.74,69.43 132.3,63.98 132.16,63.98 131.04,62.87 B_EXT.1
  Bottom 0.406: PEXT3.1 PEXT2.1 PEXT1.1 134.11,11.46 v132.72,13.15 132.72,23.05 142.35,32.69 146.41,32.69 147.8,34.09 148.78,34.09 150.32,35.62 150.32,83.12 148.64,84.8 145.71,84.8 C2_PWR.1 145.57,84.66 145.57,83.82 144.31,82.56 144.31,80.75 145.57,79.49 C2_PWR.3 145.57,79.21 v137.74,71.39 | PEXT7.1 120.84,3.62 120.84,6.27 PEXT6.1 120.98,6.55 120.98,7.53 v121.82,8.37 | PEXT5.1 127.55,3.62 127.55,6.27 PEXT4.1 127.41,6.55 127.13,6.83 v127.13,8.51
CUTDOWN_1_FIRE
  Top 0.305: R1.2 75.44,67.47 72.5,67.47 55.88,50.85 ARD_6.5
CUTDOWN_2_FIRE
  Top 0.305: R4.2 89.97,67.61 86.61,67.61 85.64,68.59 71.11,68.59 53.37,50.85 ARD_6.4
FLT_CMP_TEMP
  Top 0.305: R26.1 92.06,18.86 92.06,16.07 R27.2 91.92,15.93 88.4,12.44 | 86.22,12.44 81.42,12.44 72.92,3.91 69.85,3.91 68.59,2.65 ARD_2.7
  Top 0.406: FLT_CMP_TEMP.1 86.22,12.44 88.4,12.44 88.42,12.45
GND  (via drill 0.51)
  Top 0.305: Q4.E 129.08,87.31 129.08,87.29
  Route2 0.406: v92.6,7.8 92.6,7.84 | 92.6,7.84 92.6,9.6 v95.2,10.4 | v102.45,26.7 v106.9,26.7 | v74.9,72.7 74.93,78.32 v74.93,78.81 | v71.9,87.5 72.5,87.5 74.8,85.2 | v104.8,97.5 v104.8,91.1 104.9,91 | v119.5,87.2 v119.5,97.3 | v142.8,88.1 v140.5,85.8 136,81.3 v135.6,81.3 | v124.6,72.1 v128.5,72.1 | v97.7,63.3 v103.3,63.3 | v103.3,63.3 103.3,63.2 | v103.3,63.3 109.8,63.6 v109.8,55.8 | v107.4,74.1 107.4,74.2 v110.1,76.9 | v86.7,71.3 v95.2,71.3 | v72.86,7.64 70.06,10.64 | 70.06,10.64 70.08,7.74 v66.36,10.62 70.06,10.64 | 92.6,7.84 91.71,7.87 91.68,9.6 92.61,9.6 v90.41,11.4 | v80.69,30.48 80.7,33.38 80.72,34.73 v79.71,34.66
  Route15 0.406: v135.7,48.6 135.7,70.3 v135.5,70.5 | v135.7,46.6 135,46.6 134.4,47.2 134.4,69.6 v133.5,70.5 | 135.8,48.6 137.5,48.6 137.8,48.9 151.2,48.9 v152.5,50.2 | v136.6,44.8 136.6,45.7 137.2,46.3 144.6,46.3 145.6,47.3 152.6,47.3
  other vias: 74.9,85.1 152.5,47.3
  pour Top: 0.5,117.6 0.5,0.3 158.3,0.3 158.3,117.6
  pour Bottom: 0.5,0.3 157.3,0.3 157.3,117 0.5,117
GYRO_PWR
  Route2 0.305: GYRO.2 139.98,24.59 126.99,24.59 120.14,31.43 108.69,31.43 100.72,39.4 98.91,39.4 97.79,40.51 ARD_8.5
HEATER_1_PWR  (via drill 0.51)
  Top 0.406: v125.87,8.64 125.87,13.41 135.09,22.63 | 135.09,22.63 138.58,26.12 138.58,27.66 139.42,28.5 142.91,28.5 145.57,25.84 C3_CMD.8 | v126.71,28.36 131.46,23.61 134.11,23.61 135.09,22.63
  Bottom 0.406: v125.87,8.64 125.31,8.09 125.31,7.11 PO4.1 | v126.71,28.36 126.71,34.09 125.59,35.2 122.52,35.2 H1.1
HEATER_1_PWR_RTN  (via drill 0.51)
  Top 0.406: v139,89.55 145.15,83.4 146.27,83.4 147.66,82 148.78,82 150.04,80.75 150.04,45.54 148.22,43.73 C3_CMD.9
  Route15 0.406: H1.2 122.52,32.83 137.05,32.83 145.15,40.93 146.27,40.93 148.08,42.75 148.08,43.59 C3_CMD.9
  Bottom 0.406: v139,89.55 138.72,89.83 129.08,89.83 Q4.C
HEATER_2_PWR  (via drill 0.51)
  Route15 0.406: v124.51,2.67 124.47,8.56 121.12,11.51 121.12,27.8 122.66,29.34 130.9,29.34 H2.1
  Bottom 0.406: H2.1 131.04,29.34 133.55,29.34 145.15,40.93 148.08,40.93 C3_CMD.10 | v124.51,2.67 125.17,4.19 PO5.1
HEATER_2_PWR_RTN  (via drill 0.51)
  Top 0.406: v139.7,69.57 139.7,66.22 143.75,62.17 143.75,42.33 145.15,40.93 146.13,40.93 148.08,38.98 148.08,38.28 C3_CMD.11
  Bottom 0.406: H2.2 131.04,26.82 133.83,26.82 145.15,38.14 148.08,38.14 C3_CMD.11 | v139.7,69.57 138.16,69.57 129.5,78.23 129.08,78.23 Q5.C
HEATER_CONTROL_1  (via drill 0.51)
  Top 0.305: v110.36,88.71 110.5,88.71 111.9,87.31 112.74,87.31 115.53,90.11 125.87,90.11 127.71,88.67 130.44,88.67 131.04,87.87 131.04,85.57 v132.24,84.37 | 135.93,86.75 R10.2
  Top 0.406: v135.3,84.3 136,85 R10.2
  Route2 0.406: 135.2,84.4 v135.3,84.3 132.3,84.3 v132.24,84.37
  Route15 0.305: v110.36,88.71 109.25,87.59 87.59,87.59 79.91,79.91 69.57,79.91 40.51,50.85 ARD_7.10
HEATER_CONTROL_2
  Top 0.305: R11.2 136.07,73.9 137.19,75.02 137.19,89.55 131.88,94.86 82.56,94.86 72.75,85.03 72.75,82.52 69.57,79.36 64.54,79.35 50.85,65.66 50.85,50.85 ARD_6.3
LOAD_IN  (via drill 0.51)
  Top 0.406: LCC.6 107.01,49.59 107.01,50.01 113.44,56.44 113.44,58.67 D1.C | v116.23,57.14 117.63,58.53 121.96,58.53 D2.C
  Bottom 0.406: v116.23,57.14 115.11,57.14 113.58,58.67 D1.C
MISO
  Bottom 0.305: ARD_7.6 54.34,26.68 64.12,26.68 65.38,25.43 66.08,25.43 ARD_4.1
MOSI
  Bottom 0.305: ARD_4.4 55.6,27.94 32.83,50.71 ARD_7.7
N$15
  Top 0.305: 90.11,63.7 90.11,65.38 R4.1 | 90.11,63.7 90.11,63.01 R6.2 | 90.11,63.7 95.28,63.7 T2.2
N$16
  Top 0.305: 75.58,63.56 75.58,65.38 R1.1 | 75.58,63.56 75.58,63.01 R2.2 | 75.58,63.56 80.61,63.56 T1.2
N$18
  Top 0.305: R10.1 135.93,88.85 133.13,88.85 R12.2 132.99,88.85 132.57,88.85 129.08,92.34 Q4.B
N$19
  Top 0.305: R6.1 90.11,61.05 93.32,61.05 93.88,61.61 T2.3 94.16,61.75 95.42,60.49 96.95,60.49 97.37,60.91 99.89,60.91 R8.2
  Bottom 0.305: Q2.B 94.3,66.5 94.3,64.26 94.02,63.98 94.02,61.75 T2.3
N$22
  Top 0.305: R11.1 135.93,75.86 133.13,75.86 R13.2 133.13,76 133.13,76.69 129.08,80.75 Q5.B
N$23
  Top 0.305: R2.1 75.58,61.05 78.93,61.05 79.35,61.47 T1.3 79.49,61.47 80.61,60.35 82.42,60.35 82.98,60.91 85.5,60.91 R3.2
  Bottom 0.305: Q1.B 80.05,66.5 80.05,64.4 79.49,63.84 79.49,61.61 T1.3
N$24
  Top 0.305: R16.1 91.92,87.03 91.08,87.03 89.13,88.99 R18.2 88.85,88.99 85.78,92.06 83.54,92.06 Q6.B
N$26
  Top 0.305: R5.1 111.34,93.6 111.34,91.22 R7.2 111.48,91.08 111.48,89.41 112.32,88.57 T3.2
N$27
  Top 0.305: 109.39,86.47 111.06,86.47 T3.3 111.06,86.33 111.62,85.78 111.62,80.47 Q3.B | 109.39,86.47 108.41,86.47 R9.2 | 109.39,86.47 109.39,91.08 R7.1
N$29  (via drill 0.51)
  Route15 0.406: v77.67,75.72 79.35,74.04 83.96,74.04 91.08,81.17 95.13,81.17 120.84,55.73 120.84,45.54 122.38,44.01 122.38,43.31 B1.5
  Bottom 0.406: v77.67,75.72 65.24,75.72 60.07,80.89 50.57,80.89 B1_CELL_1.1
N$31
  Top 0.305: R17.1 91.92,77.11 89.13,77.11 R19.2 88.85,76.97 87.03,76.97 83.54,80.47 Q7.B
N$33  (via drill 0.51)
  Top 0.406: v113.16,38.28 113.16,38.84 111.76,40.23 v111.76,42.61
  Bottom 0.406: v113.16,38.28 115.39,38.28 116.93,39.81 116.93,40.23 122.38,45.68 B1.4 | v111.76,42.61 105.19,49.17 105.19,52.39 101.56,56.02 78.09,56.02 76.14,54.06 65.1,54.06 55.18,63.98 41.49,63.98 38.42,67.06 B1_CELL_2.1
N$34
  Bottom 0.406: B2.3 114.14,48.2 116.09,46.24 116.09,40.09 115.25,39.26 112.74,39.26 104.36,47.64 104.36,52.11 101.28,55.18 78.37,55.18 76.42,53.23 64.82,53.23 54.9,63.14 37.72,63.14 22.35,78.51 22.35,97.51 20.54,99.33 B3_CELL_3.1
N$35
  Bottom 0.406: B2.4 114,45.82 112.88,46.94 112.74,46.94 108.41,51.27 108.41,62.73 102.4,68.73 101.42,68.73 101,69.15 99.61,69.15 82.98,85.78 82.14,85.78 81.44,86.47 81.44,88.85 80.05,90.25 65.1,90.25 63.42,88.57 35.48,88.57 32.55,85.64 B2_CELL_2.1
N$36  (via drill 0.51)
  Route15 0.406: v98.34,72.22 100.35,71.41 108.2,63.59 108.27,61.75 112.46,57.56 112.46,45.4 114,43.87 114,43.31 B2.5
  Bottom 0.406: v98.34,72.22 97.06,73.38 85.64,84.8 85.64,92.62 79.63,98.63 45.26,98.63 44.56,99.33 B2_CELL_1.1
N$37
  Bottom 0.406: B1.3 122.38,48.34 121.68,48.34 114,56.02 112.88,56.02 109.25,59.65 109.27,64.55 104.44,69.56 102.75,69.57 86.47,85.08 86.47,92.9 79.91,99.47 49.03,99.47 45.96,102.54 42.89,102.54 26.54,86.19 26.54,81.03 B1_CELL_3.1
PYRO_1_PWR  (via drill 0.51)
  Top 0.406: v125.17,34.23 125.17,39.53 130.9,45.26 PYRO1.1
  Route15 0.406: C3_CMD.1 145.57,44.98 145.57,44.01 144.17,42.61 144.17,41.91 140.96,38.7 137.6,38.7 131.04,45.26 PYRO1.1
  Bottom 0.406: v125.17,34.23 125.17,19.7 131.74,13.13 131.74,9.9 PO1.1
PYRO_1_PWR_RTN  (via drill 0.51)
  Top 0.406: T1.1 82,61.61 82,65.8 82.7,66.5 Q1.C | v132.99,40.65 131.04,42.61 PYRO1.2
  Route15 0.406: T1.1 82,61.47 83.54,61.47 96.39,48.62 96.39,42.75 97.23,41.91 110.92,41.91 113.58,39.26 127.55,39.26 130.9,42.61 PYRO1.2
  Bottom 0.406: v132.99,40.65 137.05,40.65 139,38.7 141.8,38.7 145.29,42.19 145.57,42.19 C3_CMD.2
PYRO_2_PWR  (via drill 0.51)
  Top 0.406: PYRO2.1 131.04,37.3 143.47,37.3 145.35,39.21 C3_CMD.3
  Route15 0.406: v131.19,5.74 132.92,5.74 136.4,9.2 136.4,26 139.9,29.5 141.8,29.5 142.8,28.5 142.8,24.6 144.8,22.6 149.2,22.6 152.5,25.9 152.5,37.8 150.7,39.5 C3_CMD.3
  Bottom 0.406: v131.19,5.74 131.2,6.63 PO2.1
PYRO_2_PWR_RTN
  Top 0.406: T2.1 96.67,61.75 96.67,66.36 96.81,66.5 Q2.C | PYRO2.2 131.04,34.78 143.47,34.78 145.57,36.88 C3_CMD.4
  Route2 0.406: T2.1 96.67,61.61 96.67,58.95 105.61,50.01 105.61,47.22 116.23,36.6 129.08,36.6 130.9,34.78 PYRO2.2
RESET  (via drill 0.51)
  Top 0.305: v67.33,26.96 66.92,26.96 66.64,26.68 61.47,26.68 39.26,4.47 v37.44,4.47
  Route15 0.305: v102.42,31.71 67.33,31.71 66.22,30.59 ARD_4.5
  Bottom 0.305: v67.33,26.96 67.33,28.5 66.22,29.62 66.22,30.45 ARD_4.5 | v37.44,4.47 35.62,2.65 ARD_1.3 | v102.42,31.71 107.61,37.3 128.1,37.3 133.27,42.47 140.4,42.47 ON/OFF.9
RX0
  Top 0.305: X12.2 11.87,35.9 48.62,35.9 63.42,50.71 ARD_6.8
RX1  (via drill 0.51)
  Route2 0.305: v95,28.92 97.23,26.68 98.21,26.68 99.05,25.84 99.05,25.01 100.03,24.03 100.86,24.03 106.31,18.58 106.31,17.46 107.43,16.34 GPS.5
  Bottom 0.305: v95,28.92 81.31,42.61 81.31,50.71 ARD_5.6
RX3  (via drill 0.51)
  Top 0.305: v43.59,55.18 38.42,60.35 RB1.2
  Bottom 0.305: v43.59,55.18 61.05,55.18 66.78,49.45 69.15,49.45 70.41,50.71 71.11,50.71 ARD_5.2
S/A_PWR_IN
  Top 0.406: C2_PWR.8 145.71,65.66 145.71,66.5 146.96,67.75 146.96,69.01 145.71,70.27 145.71,70.97 C2_PWR.6 145.71,71.25 145.71,71.81 146.96,73.06 146.96,74.32 146.82,74.46 146.82,75.72 146.96,75.86 146.96,77.11 146.82,77.25 146.82,78.37 148.08,79.63 148.08,80.61 C2_PWR.10
  Bottom 0.406: SACC.6 125.59,75.86 126.29,75.86 137.19,64.96 141.94,64.96 142.07,64.82 142.49,64.82 142.63,64.68 144.73,64.68 145.57,65.52 C2_PWR.8
S/A_PWR_OUT
  Top 0.406: MPPT.3 130.9,54.34 126.99,58.26 126.99,77.11 125.59,78.51 SACC.5
S/A_PWR_RTN  (via drill 0.51)
  Top 0.406: v137.6,66.08 131.04,59.51 131.04,56.86 MPPT.4
  Bottom 0.406: C2_PWR.9 148.22,83.4 149.48,82.14 149.48,80.05 148.22,78.79 148.22,77.95 C2_PWR.11 148.08,77.81 148.08,77.11 146.13,75.16 145.15,75.16 144.31,74.32 144.31,70.41 144.17,70.27 | v137.6,66.08 141.8,70.27 144.17,70.27 | 144.17,70.27 145.57,68.87 145.57,68.45 C2_PWR.7
SCK
  Bottom 0.305: ARD_4.3 65.38,27.94 64.12,29.2 63.14,29.2 41.77,50.57 41.77,51.27 40.93,52.11 29.06,52.11 27.8,50.85 ARD_7.5
SCL  (via drill 0.51)
  Top 0.305: GYRO.4 139.98,19.28 139.98,18.72 133.41,12.15 133.41,11.6 126.99,6.97 121.82,6.97 115.95,11.04 115.95,28.22 104.78,39.4 104.78,54.9 106.87,57 LCC.3 | v95,59.65 86.47,51.13 86.47,50.85 ARD_5.8 | v99.33,83.96 98.21,83.96 93.46,79.21 88.43,79.21 83.96,83.68 79.49,83.68 B1CC.3
  Bottom 0.305: SACC.3 125.45,83.68 125.31,83.82 102.68,83.82 B2CC.3 102.4,83.82 99.47,83.82 v99.33,83.96 | 99.95,63.49 106.31,57.14 106.87,57.14 LCC.3 | B1CC.3 79.49,83.68 80.82,83.68 81.78,79.33 85.7,79.33 86.31,76.41 93.51,69.04 95,69.04 95.6,68.4 95.6,65.2 96.2,64.5 98.9,64.5 99.95,63.49 | v95,59.65 96.11,59.65 99.95,63.49
SDA  (via drill 0.51)
  Top 0.305: v90.11,57.14 83.82,50.85 ARD_5.7
  Route2 0.305: GYRO.3 140.12,22.07 140.12,22.91 141.24,24.03 141.24,25.43 140.96,25.7 140.96,26.26 141.24,26.54 141.24,28.78 125.59,44.42 119.58,44.42 114.41,49.59 111.9,49.59 107.01,54.48 LCC.4 | B2CC.4 102.54,81.44 84.24,81.44 83.96,81.72 79.91,81.72 79.49,81.31 B1CC.4
  Bottom 0.305: SACC.4 125.45,81.17 118.47,81.17 117.21,82.42 103.66,82.42 102.68,81.44 B2CC.4 | LCC.4 106.87,54.62 104.36,57.14 v90.11,57.14 90.11,64.12 81.44,72.78 81.44,78.65 79.49,80.61 79.49,81.17 B1CC.4
SPARE_1_PWR  (via drill 0.51)
  Top 0.406: v127.33,19.84 123.56,19.85 SPRL1.1 119.2,19.8 v119.2,11.3
  Bottom 0.406: v127.33,19.84 128.38,19.84 143.89,35.34 148.08,35.34 C3_CMD.12 | v119.2,11.3 119.2,8.2 118.62,7.6 PO6.1
SPARE_1_PWR_RTN  (via drill 0.51)
  Top 0.406: v101.98,93.74 82.42,93.74 81.44,92.76 81.44,91.64 83.4,89.69 Q6.C | v133.69,22.63 128.38,17.32 122.52,17.32 SPRL1.2
  Bottom 0.406: v101.98,93.74 140.68,93.74 148.92,85.5 149.06,85.5 151.16,83.4 151.16,35.34 148.5,32.69 148.22,32.69 C3_CMD.13 148.08,32.55 148.08,31.85 146.13,29.9 140.82,29.9 138.58,27.66 138.58,27.52 v133.69,22.63
SPARE_2_PWR  (via drill 0.51)
  Top 0.406: v132.74,30.73 144.31,30.73 145.15,29.9 148.08,29.9 C3_CMD.14
  Route15 0.406: v118.07,2.49 118.07,32.6 114.14,35.2 SPRL2.1
  Bottom 0.406: v132.74,30.73 126.07,36.6 121.26,36.6 120,35.34 114.14,35.34 SPRL2.1 | v118.07,2.49 118.61,4.19 PO7.1
SPARE_2_PWR_RTN  (via drill 0.51)
  Top 0.406: C3_CMD.15 148.22,27.24 148.22,28.08 149.62,29.48 149.62,33.11 148.64,34.09 147.52,34.09 146.27,35.34 145.15,35.34 142.49,32.69 126.15,32.69 124.05,30.59 116.23,30.59 114.14,32.69 SPRL2.2
  Route2 0.406: v96.11,58.12 96.25,58.12 99.89,54.48 99.89,54.06 99.75,53.92 99.75,53.09 100.72,52.11 102.26,52.11 104.78,49.59 104.78,42.19 114.14,32.83 SPRL2.2
  Bottom 0.406: v96.11,58.12 95.14,58.12 92.76,60.49 92.76,68.73 83.54,77.95 Q7.C
SPARE_HIGH_1_CONTROL  (via drill 0.51)
  Top 0.305: v100.72,53.51 101.14,53.92 101.14,63.7 100.86,63.98 99.47,63.98 98.21,65.24 98.21,67.75 97.37,68.59 96.53,68.59 90.81,74.32 90.81,75.72 91.08,76 95,76 100.31,81.31 100.31,88.57 105.33,93.6 109.25,93.6 R5.2
  Bottom 0.305: v100.72,53.51 100.72,52.25 101.7,51.27 101.7,49.59 100.44,48.34 ARD_9.2
SPARE_HIGH_1_PWR  (via drill 0.51)
  Top 0.406: SPRH1.1 122.52,27.38 124.33,27.38 128.8,31.85 143.47,31.85 145.57,33.95 C3_CMD.5
  Route2 0.406: v133.69,19.42 129.22,23.89 125.87,23.89 122.52,27.24 SPRH1.1
  Bottom 0.406: v133.69,19.42 135.37,17.74 135.37,2.1 134.95,1.68 133.27,1.68 131.88,3.07 131.88,4.19 PO3.1
SPARE_HIGH_1_PWR_RTN  (via drill 0.51)
  Top 0.406: T3.1 113.72,86.47 113.72,80.89 114.14,80.47 Q3.C
  Route2 0.406: v128.8,63.7 128.8,63.01 130.48,61.33 131.32,61.33 139,53.65 139,38 145.57,31.43 C3_CMD.6
  Route15 0.406: SPRH1.2 122.52,24.87 132.53,24.87 139.05,31.29 145.57,31.29 C3_CMD.6
  Bottom 0.406: v128.8,63.7 128.66,63.7 114.28,78.09 114.28,80.33 Q3.C
SPARE_LOW_1_CONTROL  (via drill 0.51)
  Top 0.305: v93.18,80.19 93.18,87.87 92.06,88.99 R16.2
  Route15 0.305: v93.18,80.19 93.18,69.28 98.21,68.36 98.21,64.91 99.05,64.07 99.05,47.08 100.31,45.82 ARD_9.3
SPARE_LOW_2_CONTROL
  Top 0.305: R17.2 92.06,74.88 94.25,74.88 101.82,67.34 101.7,44.56 100.44,43.31 ARD_9.4
TEMP_EXT_1  (via drill 0.51)
  Top 0.305: R22.1 68.03,19 68.03,16.07 R23.2 68.03,15.93 v69.43,14.53
  Route2 0.305: v69.43,14.53 62.31,21.65 62.31,94.16 54.06,102.4 54.06,103.52 52.25,105.33 51.27,105.33 C1_TLM.1
  Bottom 0.305: v69.43,14.53 69.43,4.33 71.11,2.65 ARD_2.8
TEMP_EXT_2  (via drill 0.51)
  Top 0.305: ARD_2.6 66.08,2.65 70.41,6.99 70.41,14.39 71.94,15.93 R25.2 72.08,16.07 72.08,19 R24.1 71.94,19.14 70.97,20.12 v69.95,20.12
  Route2 0.305: v69.95,20.12 69.85,20.82 69.85,87.73 54.62,102.96 54.62,104.08 55.88,105.33 56.58,105.33 C1_TLM.3
TX0
  Top 0.305: X12.3 11.87,38 48.2,38 60.91,50.71 ARD_6.7
TX1  (via drill 0.51)
  Top 0.305: v105.47,37.16 105.47,15.79 107.43,13.83 GPS.4
  Bottom 0.305: v105.47,37.16 103.66,38.98 103.66,51.83 101,54.48 83.12,54.48 79.49,50.85 78.79,50.85 ARD_5.5
TX3
  Bottom 0.305: ARD_5.1 68.45,50.85 66.22,50.85 57.98,59.09 37.16,59.09 35.9,60.35 RB1.3
VIN  (via drill 0.51)
  Top 0.406: R14.2 58.95,14.39 58.95,13.27 48.34,2.65 ARD_1.8 | v109.25,36.32 105.47,40.09 105.47,50.01 106.87,51.41 106.87,51.97 LCC.5
  Route2 0.406: v103.66,3.77 101.98,5.45 99.19,5.45 95,1.26 50.57,1.26 49.31,2.52 48.34,2.52 ARD_1.8
  Bottom 0.406: PVIN3.1 129.5,3.62 129.5,6.27 PVIN2.1 129.5,6.55 129.5,9.06 PVIN1.1 129.36,9.2 127.83,9.2 127.41,9.62 127.41,12.52 123.04,12.54 | PVIN7.1 116.37,3.62 116.37,6.27 PVIN6.1 | PVIN5.1 PVIN4.1 123.04,12.54 | 118.23,13.24 116.37,7.39 116.37,6.55 PVIN6.1 | 118.23,13.24 121.84,13.24 123.04,12.54 | v109.25,36.32 109.25,34.78 118.79,25.14 118.69,14.28 118.23,13.24 | v103.66,3.77 114.23,3.77 PVIN6.1
VIN_VOLTAGE_TLM
  Top 0.305: R15.2 61.05,17.88 61.05,14.53 R14.1 61.05,14.39 61.05,10.06 C1.1 61.05,9.92 61.05,2.65 ARD_2.4

### Text on the board
tNames: AlphaNewt v1.0 / ASTRONEWTS LLC | EXTERNAL BATTERY | ROCKBLOCK | Battery 2 / Current Sense | Battery 1 / Current Sense | Solar Array / Current Sense | USB-A | LOAD / Current Sense | MPPT | SD BOARD | GPS BOARD | Flight Temp Sensor | ALTIMETER
bNames: BATTERY 1 | BATTERY 2 | Battery 2 Charger | Battery 1 Charger | GYRO BOARD | VIN | B_EXT | ARDUINO | VIN | B_EXT | VIN | B_EXT | P1 | P6 | P4 | P2 | GYRO | P7 | P5 | P3